# Altium project HANC1.0.PrjPcb
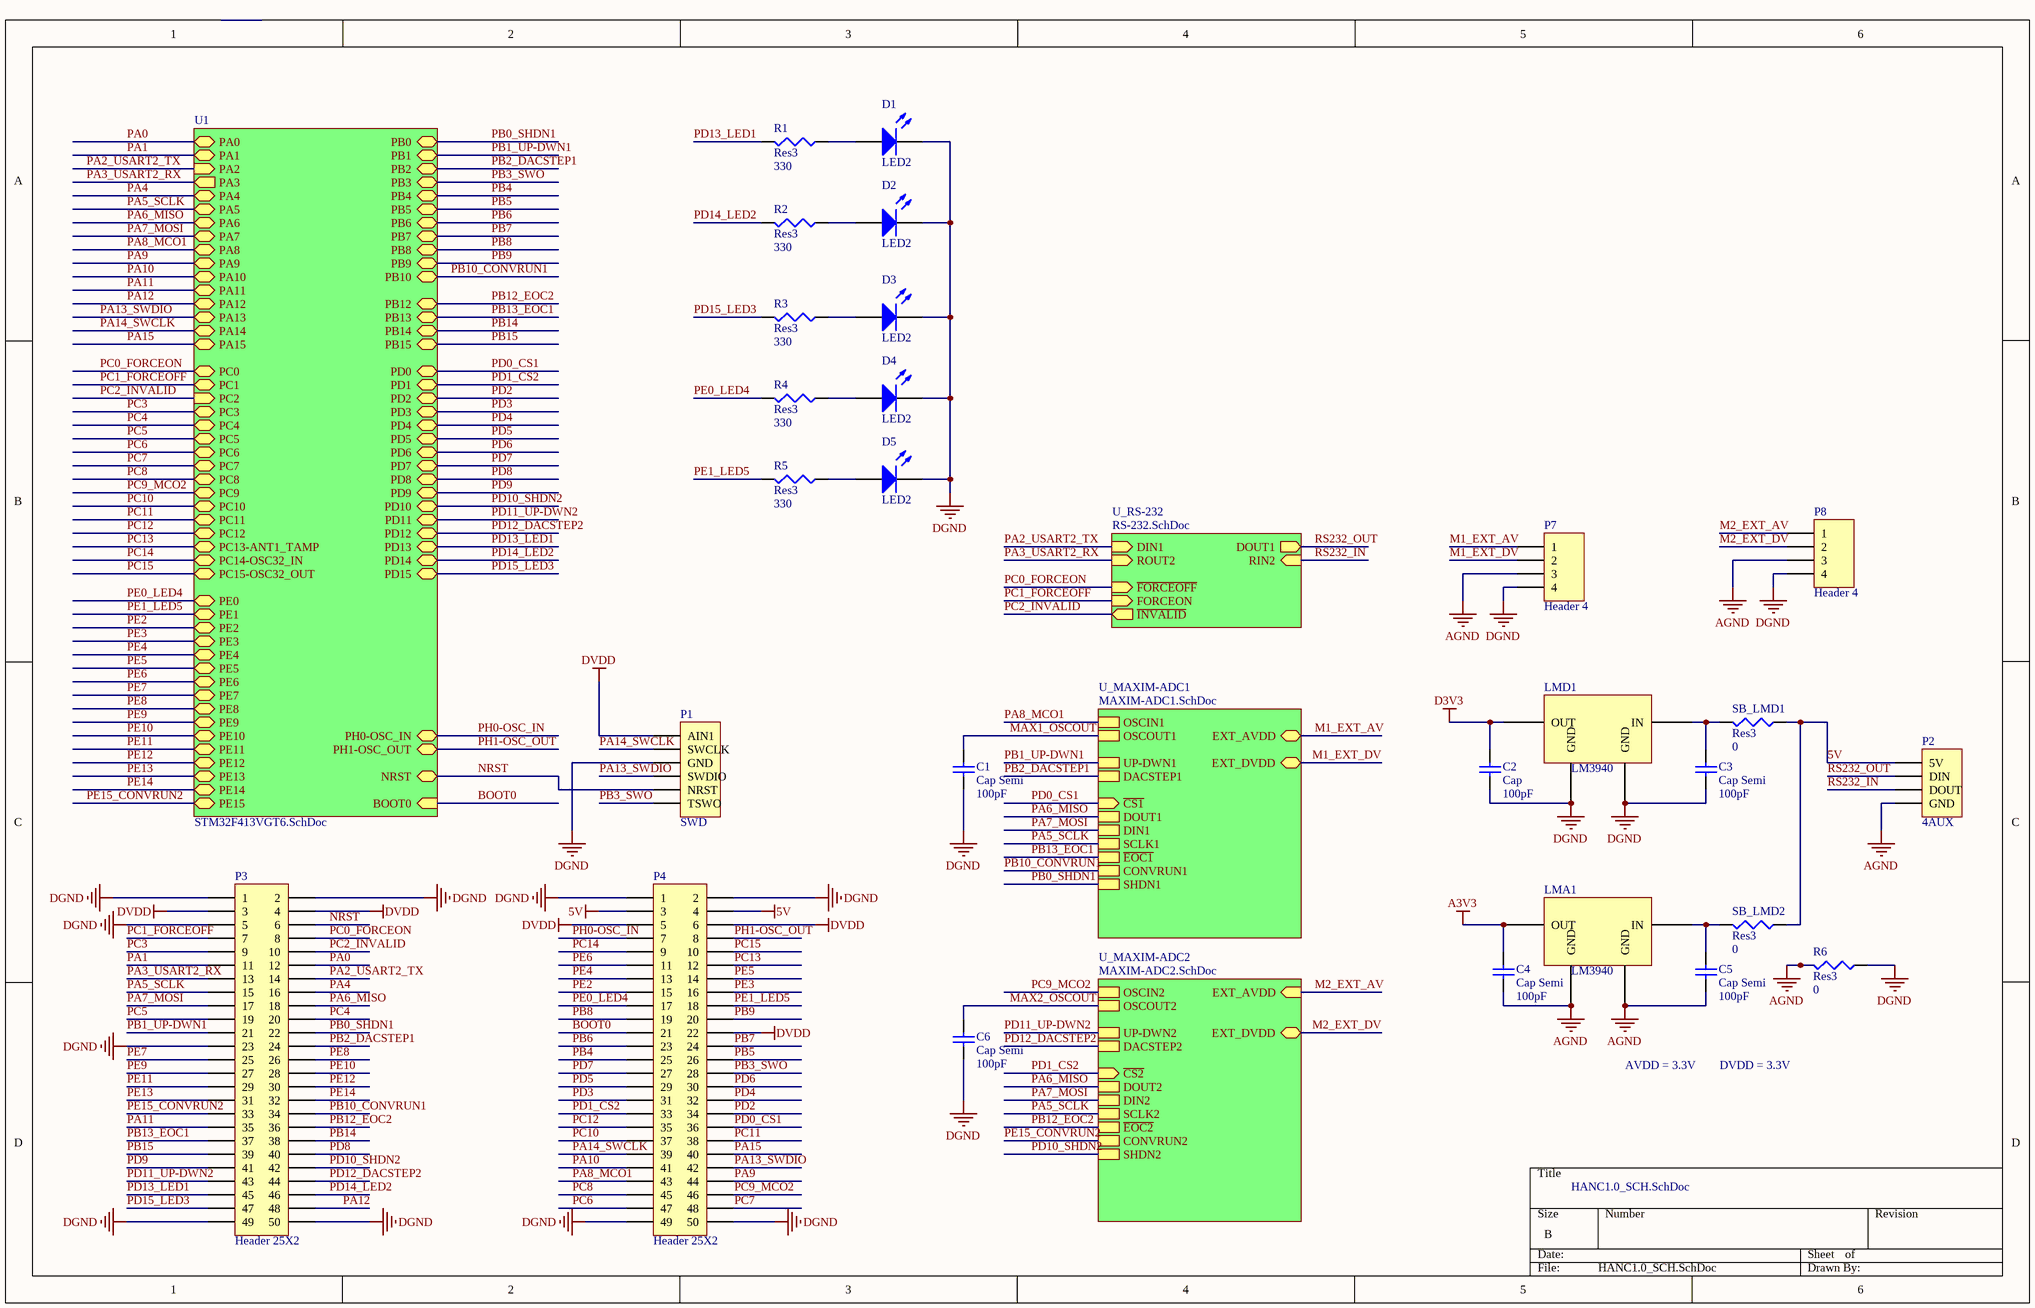
[diagram p0: HANC1.0_SCH.SchDoc]
7 sheets, 215 parts. Net scope: hierarchical (ports join the sheet entries above them; power ports are global).
Board file: HANCv1.PcbDoc
Sheets:
  HANC1.0_SCH.SchDoc
    U1 = STM32F413VGT6.SchDoc
    U_RS-232 = RS-232.SchDoc
    U_MAXIM-ADC2 = MAXIM-ADC2.SchDoc
      HAMP2 = HydrophoneGroup2FilterAndAmpCircuit.SchDoc
    U_MAXIM-ADC1 = MAXIM-ADC1.SchDoc
      HAMP1 = HydrophoneGroup1FilterAndAmpCircuit.SchDoc

## Sheet HANC1.0_SCH.SchDoc
size B

### Parts
C1  Cap Semi  value 100pF  [1608[0603]]
C2  Cap  value 100pF  [1608[0603]]
C3  Cap Semi  value 100pF  [1608[0603]]
C4  Cap Semi  value 100pF  [1608[0603]]
C5  Cap Semi  value 100pF  [1608[0603]]
C6  Cap Semi  value 100pF  [1608[0603]]
D1  LED2  [3.2X1.6X1.1]
D2  LED2  [3.2X1.6X1.1]
D3  LED2  [3.2X1.6X1.1]
D4  LED2  [3.2X1.6X1.1]
D5  LED2  [3.2X1.6X1.1]
LMA1  LM3940  [SOT223_N]
LMD1  LM3940  [SOT223_N]
P1  SWD  [HDR1X6]
P2  4AUX  [HDR1X4]
P3  Header 25X2  [HDR2X25]
P4  Header 25X2  [HDR2X25]
P7  Header 4  [HDR1X4]
P8  Header 4  [HDR1X4]
R1  Res3  value 330  [J1-0603]
R2  Res3  value 330  [J1-0603]
R3  Res3  value 330  [J1-0603]
R4  Res3  value 330  [J1-0603]
R5  Res3  value 330  [J1-0603]
R6  Res3  value 0  [J1-0603]
SB_LMD1  Res3  value 0  [J1-0603]
SB_LMD2  Res3  value 0  [J1-0603]

### Sub-sheets
U1 = STM32F413VGT6.SchDoc: PE2 (bidir), PH0-OSC_IN (bidir), PH1-OSC_OUT (bidir), NRST (bidir), PC0 (bidir), PC1 (bidir), PC2 (in), PC3 (bidir), PE3 (bidir), PA0 (bidir), PA1 (bidir), PA2 (in), PA3 (out), PA4 (bidir), PE4 (bidir), PA5 (bidir), PA6 (bidir), PA7 (bidir), PC4 (bidir), PC5 (bidir), PB0 (bidir), PB1 (bidir), PB2 (bidir), PE7 (bidir), PE8 (bidir), PE5 (bidir), PE9 (bidir), PE10 (bidir), PE11 (bidir), PE12 (bidir), PE13 (bidir), PE14 (bidir), PE15 (bidir), PB10 (bidir), PE6 (bidir), PB12 (bidir), PB13 (bidir), PB14 (bidir), PB15 (bidir), PD8 (bidir), PD9 (bidir), PD10 (bidir), PD11 (bidir), PD12 (bidir), PD13 (bidir), PD14 (bidir), PD15 (bidir), PC6 (bidir), PC7 (bidir), PC8 (bidir), PC9 (bidir), PA8 (bidir), PA9 (bidir), PA10 (bidir), PC13-ANT1_TAMP (bidir), PA11 (bidir), PA12 (bidir), PA13 (bidir), PA14 (bidir), PA15 (bidir), PC10 (bidir), PC11 (bidir), PC14-OSC32_IN (bidir), PC12 (bidir), PD0 (bidir), PD1 (bidir), PD2 (bidir), PD3 (bidir), PD4 (bidir), PD5 (bidir), PD6 (bidir), PD7 (bidir), PB3 (bidir), PC15-OSC32_OUT (bidir), PB4 (bidir), PB5 (bidir), PB6 (bidir), PB7 (bidir), BOOT0, PB8 (bidir), PB9 (bidir), PE0 (bidir), PE1 (bidir)
U_MAXIM-ADC1 = MAXIM-ADC1.SchDoc: OSCIN1, OSCOUT1, UP-DWN1, DACSTEP1, ~{CS1} (in), DOUT1, DIN1, SCLK1, ~{EOC1}, CONVRUN1, SHDN1, EXT_AVDD, EXT_DVDD
U_MAXIM-ADC2 = MAXIM-ADC2.SchDoc: OSCIN2, OSCOUT2, UP-DWN2, DACSTEP2, ~{CS2} (in), DOUT2, DIN2, SCLK2, ~{EOC2}, CONVRUN2, SHDN2, EXT_AVDD (in), EXT_DVDD
U_RS-232 = RS-232.SchDoc: DIN1 (in), RIN2 (in), ~{FORCEOFF} (in), FORCEON (in), DOUT1 (out), ROUT2 (in), ~{INVALID} (out)

### Nets
5V: P2.1(5V) P4.3 P4.4 SB_LMD1.1 SB_LMD2.1
A3V3: C4.2 LMA1.3(OUT)
AGND: C4.1 C5.1 LMA1.2(GND) LMA1.4(GND) P2.4(GND) P7.3 P8.3 R6.2
D3V3: C2.2 LMD1.3(OUT)
DGND: C1.1 C2.1 C3.1 C6.1 D1.2(K) D2.2(K) D3.2(K) D4.2(K) D5.2(K) LMD1.2(GND) LMD1.4(GND) P1.3(GND) P3.1 P3.2 P3.5 P3.23 P3.49 P3.50 P4.1 P4.2 P4.49 P4.50 P7.4 P8.4 R6.1
DVDD: P1.1(AIN1) P3.3 P3.4 P4.5 P4.6 P4.22
BOOT0: P4.21 ; sheet U1/BOOT0
M1_EXT_AV: P7.1 ; sheet U_MAXIM-ADC1/EXT_AVDD
M1_EXT_DV: P7.2 ; sheet U_MAXIM-ADC1/EXT_DVDD
M2_EXT_AV: P8.1 ; sheet U_MAXIM-ADC2/EXT_AVDD
M2_EXT_DV: P8.2 ; sheet U_MAXIM-ADC2/EXT_DVDD
MAX1_OSCOUT: C1.2 ; sheet U_MAXIM-ADC1/OSCOUT1
MAX2_OSCOUT: C6.2 ; sheet U_MAXIM-ADC2/OSCOUT2
NRST: P1.5(NRST) P3.6 ; sheet U1/NRST
PA0: P3.12 ; sheet U1/PA0
PA1: P3.11 ; sheet U1/PA1
PA2_USART2_TX: P3.14 ; sheet U1/PA2, sheet U_RS-232/DIN1
PA3_USART2_RX: P3.13 ; sheet U1/PA3, sheet U_RS-232/ROUT2
PA4: P3.16 ; sheet U1/PA4
PA5_SCLK: P3.15 ; sheet U1/PA5, sheet U_MAXIM-ADC2/SCLK2, sheet U_MAXIM-ADC1/SCLK1
PA6_MISO: P3.18 ; sheet U1/PA6, sheet U_MAXIM-ADC2/DOUT2, sheet U_MAXIM-ADC1/DOUT1
PA7_MOSI: P3.17 ; sheet U1/PA7, sheet U_MAXIM-ADC2/DIN2, sheet U_MAXIM-ADC1/DIN1
PA8_MCO1: P4.43 ; sheet U1/PA8, sheet U_MAXIM-ADC1/OSCIN1
PA9: P4.44 ; sheet U1/PA9
PA10: P4.41 ; sheet U1/PA10
PA11: P3.35 ; sheet U1/PA11
PA12: P3.48 ; sheet U1/PA12
PA13_SWDIO: P1.4(SWDIO) P4.42 ; sheet U1/PA13
PA14_SWCLK: P1.2(SWCLK) P4.39 ; sheet U1/PA14
PA15: P4.40 ; sheet U1/PA15
PB0_SHDN1: P3.22 ; sheet U1/PB0, sheet U_MAXIM-ADC1/SHDN1
PB1_UP-DWN1: P3.21 ; sheet U1/PB1, sheet U_MAXIM-ADC1/UP-DWN1
PB2_DACSTEP1: P3.24 ; sheet U1/PB2, sheet U_MAXIM-ADC1/DACSTEP1
PB3_SWO: P1.6(TSWO) P4.28 ; sheet U1/PB3
PB4: P4.25 ; sheet U1/PB4
PB5: P4.26 ; sheet U1/PB5
PB6: P4.23 ; sheet U1/PB6
PB7: P4.24 ; sheet U1/PB7
PB8: P4.19 ; sheet U1/PB8
PB9: P4.20 ; sheet U1/PB9
PB10_CONVRUN1: P3.34 ; sheet U1/PB10, sheet U_MAXIM-ADC1/CONVRUN1
PB12_EOC2: P3.36 ; sheet U1/PB12, sheet U_MAXIM-ADC2/~{EOC2}
PB13_EOC1: P3.37 ; sheet U1/PB13, sheet U_MAXIM-ADC1/~{EOC1}
PB14: P3.38 ; sheet U1/PB14
PB15: P3.39 ; sheet U1/PB15
PC0_FORCEON: P3.8 ; sheet U1/PC0, sheet U_RS-232/~{FORCEOFF}
PC1_FORCEOFF: P3.7 ; sheet U1/PC1, sheet U_RS-232/FORCEON
PC2_INVALID: P3.10 ; sheet U1/PC2, sheet U_RS-232/~{INVALID}
PC3: P3.9 ; sheet U1/PC3
PC4: P3.20 ; sheet U1/PC4
PC5: P3.19 ; sheet U1/PC5
PC6: P4.47 ; sheet U1/PC6
PC7: P4.48 ; sheet U1/PC7
PC8: P4.45 ; sheet U1/PC8
PC9_MCO2: P4.46 ; sheet U1/PC9, sheet U_MAXIM-ADC2/OSCIN2
PC10: P4.37 ; sheet U1/PC10
PC11: P4.38 ; sheet U1/PC11
PC12: P4.35 ; sheet U1/PC12
PC13: P4.12 ; sheet U1/PC13-ANT1_TAMP
PC14: P4.9 ; sheet U1/PC14-OSC32_IN
PC15: P4.10 ; sheet U1/PC15-OSC32_OUT
PD0_CS1: P4.36 ; sheet U1/PD0, sheet U_MAXIM-ADC1/~{CS1}
PD1_CS2: P4.33 ; sheet U1/PD1, sheet U_MAXIM-ADC2/~{CS2}
PD2: P4.34 ; sheet U1/PD2
PD3: P4.31 ; sheet U1/PD3
PD4: P4.32 ; sheet U1/PD4
PD5: P4.29 ; sheet U1/PD5
PD6: P4.30 ; sheet U1/PD6
PD7: P4.27 ; sheet U1/PD7
PD8: P3.40 ; sheet U1/PD8
PD9: P3.41 ; sheet U1/PD9
PD10_SHDN2: P3.42 ; sheet U1/PD10, sheet U_MAXIM-ADC2/SHDN2
PD11_UP-DWN2: P3.43 ; sheet U1/PD11, sheet U_MAXIM-ADC2/UP-DWN2
PD12_DACSTEP2: P3.44 ; sheet U1/PD12, sheet U_MAXIM-ADC2/DACSTEP2
PD13_LED1: P3.45 R1.2 ; sheet U1/PD13
PD14_LED2: P3.46 R2.2 ; sheet U1/PD14
PD15_LED3: P3.47 R3.2 ; sheet U1/PD15
PE0_LED4: P4.17 R4.2 ; sheet U1/PE0
PE1_LED5: P4.18 R5.2 ; sheet U1/PE1
PE2: P4.15 ; sheet U1/PE2
PE3: P4.16 ; sheet U1/PE3
PE4: P4.13 ; sheet U1/PE4
PE5: P4.14 ; sheet U1/PE5
PE6: P4.11 ; sheet U1/PE6
PE7: P3.25 ; sheet U1/PE7
PE8: P3.26 ; sheet U1/PE8
PE9: P3.27 ; sheet U1/PE9
PE10: P3.28 ; sheet U1/PE10
PE11: P3.29 ; sheet U1/PE11
PE12: P3.30 ; sheet U1/PE12
PE13: P3.31 ; sheet U1/PE13
PE14: P3.32 ; sheet U1/PE14
PE15_CONVRUN2: P3.33 ; sheet U1/PE15, sheet U_MAXIM-ADC2/CONVRUN2
PH0-OSC_IN: P4.7 ; sheet U1/PH0-OSC_IN
PH1-OSC_OUT: P4.8 ; sheet U1/PH1-OSC_OUT
RS232_IN: P2.3(DOUT) ; sheet U_RS-232/RIN2
RS232_OUT: P2.2(DIN) ; sheet U_RS-232/DOUT1
NetC3_2: C3.2 LMD1.1(IN) SB_LMD1.2
NetC5_2: C5.2 LMA1.1(IN) SB_LMD2.2
NetD1_1: D1.1(A) R1.1
NetD2_1: D2.1(A) R2.1
NetD3_1: D3.1(A) R3.1
NetD4_1: D4.1(A) R4.1
NetD5_1: D5.1(A) R5.1

### Notes on the sheet
- AVDD = 3.3V
- DVDD = 3.3V

### Library data of the parts
C1-C6 = Cap Semi: Capacitor (Semiconductor SIM Model); Published: 8-Jun-2000; LatestRevisionDate: 29-May-2009; LatestRevisionNote: IPC-7351 Footprint Added.; PackageReference: C1206; Publisher: Altium Limited; PackageDescription: Chip Capacitor
D1-D5 = LED2: Typical RED, GREEN, YELLOW, AMBER GaAs LED; Published: 8-Jun-2000; LatestRevisionDate: 17-Jul-2002; LatestRevisionNote: Re-released for DXP Platform.; PackageVersion: Feb-2002; PackageReference: 3.2X1.6X1.1; Publisher: Altium Limited; PackageDescription: SM LED; 2 Flat Leads
LMA1 LMD1 = Component_1
P1 = Header 6: Header, 6-Pin; LatestRevisionDate: 17-Jul-2002; LatestRevisionNote: Re-released for DXP Platform.; Publisher: Altium Limited
P2 P7 P8 = Header 4: Header, 4-Pin; LatestRevisionDate: 17-Jul-2002; LatestRevisionNote: Re-released for DXP Platform.; Publisher: Altium Limited
P3 P4 = Header 25X2: Header, 25-Pin, Dual row; LatestRevisionDate: 17-Jul-2002; LatestRevisionNote: Re-released for DXP Platform.; Publisher: Altium Limited
R1-R6 SB_LMD1 SB_LMD2 = Res3: Resistor; Published: 8-Jun-2000; LatestRevisionDate: 29-May-2009; LatestRevisionNote: IPC-7351 Footprint Added.; PackageReference: J1-0603; Publisher: Altium Limited; PackageDescription: Chip Resistor

## Sheet STM32F413VGT6.SchDoc
size A3; PageSetup: Record=PageOptions|CenterHorizontal=True|CenterVertical=True|PrintScale=0.70|XCorrection=1.00|YCorrection=1.00|PrintKind=1|BorderSize=5000000|LeftOffset=0|BottomOffset=0|Orientation=2|PaperLength=1000|PaperWidth=1000|Scale=100|PaperSource=7|PrintQuality=600|MediaType=1|DitherType=10|PrintScaleMode=1|PaperKind=Letter|PaperIndex=1
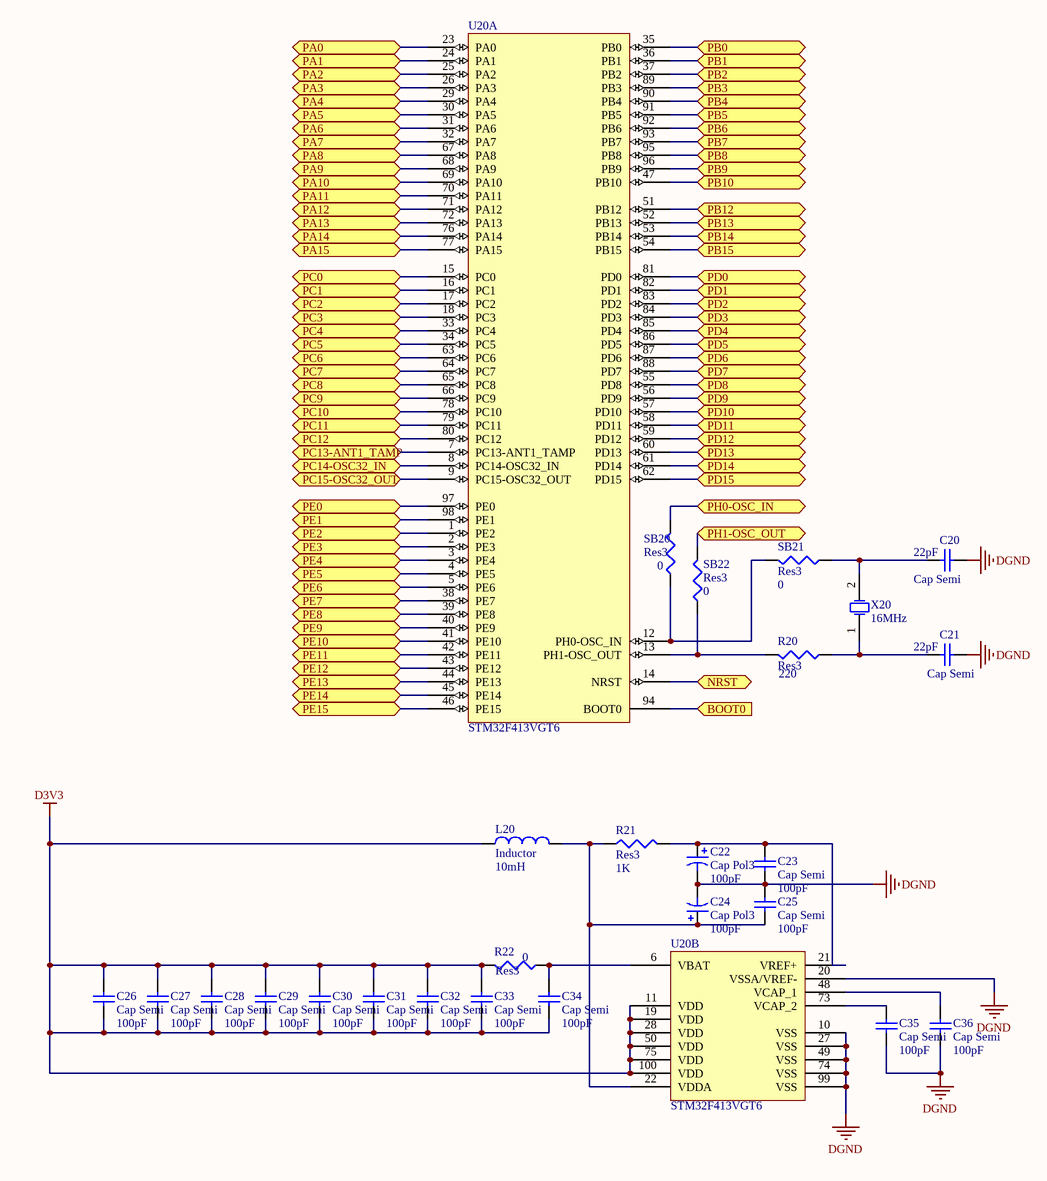
[diagram p1: STM32F413VGT6.SchDoc]

### Parts
(Parts that share a designator on the sheet are numbered #1, #2 ... from top to bottom, then left to right.)
C20  Cap Semi  value 22pF  [1608[0603]]
C21  Cap Semi  value 22pF  [1608[0603]]
C22  Cap Pol3  value 100pF  [C0805]
C23  Cap Semi  value 100pF  [1608[0603]]
C24  Cap Pol3  value 100pF  [C0805]
C25  Cap Semi  value 100pF  [1608[0603]]
C26  Cap Semi  value 100pF  [1608[0603]]
C27  Cap Semi  value 100pF  [1608[0603]]
C28  Cap Semi  value 100pF  [1608[0603]]
C29  Cap Semi  value 100pF  [1608[0603]]
C30  Cap Semi  value 100pF  [1608[0603]]
C31  Cap Semi  value 100pF  [1608[0603]]
C32  Cap Semi  value 100pF  [1608[0603]]
C33  Cap Semi  value 100pF  [1608[0603]]
C34  Cap Semi  value 100pF  [1608[0603]]
C35  Cap Semi  value 100pF  [1608[0603]]
C36  Cap Semi  value 100pF  [1608[0603]]
L20  Inductor  value 10mH  [0603]
R20  Res3  value 220  [J1-0603]
R21  Res3  value 1K  [J1-0603]
R22  Res3  value 0  [J1-0603]
SB20  Res3  value 0  [J1-0603]
SB21  Res3  value 0  [J1-0603]
SB22  Res3  value 0  [J1-0603]
U20#1  STM32F413VGT6  [STM-LQFP100_V]  (part A of 2)
U20#2  STM32F413VGT6  [STM-LQFP100_V]  (part B of 2)
X20  16MHz  [R38]

### Ports
BOOT0, NRST (bidir), PA0 (bidir), PA1 (bidir), PA2 (bidir), PA3 (bidir), PA4 (bidir), PA5 (bidir), PA6 (bidir), PA7 (bidir), PA8 (bidir), PA9 (bidir), PA10 (bidir), PA11 (bidir), PA12 (bidir), PA13 (bidir), PA14 (bidir), PA15 (bidir), PB0 (bidir), PB1 (bidir), PB2 (bidir), PB3 (bidir), PB4 (bidir), PB5 (bidir), PB6 (bidir), PB7 (bidir), PB8 (bidir), PB9 (bidir), PB10 (bidir), PB12 (bidir), PB13 (bidir), PB14 (bidir), PB15 (bidir), PC0 (bidir), PC1 (bidir), PC2 (bidir), PC3 (bidir), PC4 (bidir), PC5 (bidir), PC6 (bidir), PC7 (bidir), PC8 (bidir), PC9 (bidir), PC10 (bidir), PC11 (bidir), PC12 (bidir), PC13-ANT1_TAMP (bidir), PC14-OSC32_IN (bidir), PC15-OSC32_OUT (bidir), PD0 (bidir), PD1 (bidir), PD2 (bidir), PD3 (bidir), PD4 (bidir), PD5 (bidir), PD6 (bidir), PD7 (bidir), PD8 (bidir), PD9 (bidir), PD10 (bidir), PD11 (bidir), PD12 (bidir), PD13 (bidir), PD14 (bidir), PD15 (bidir), PE0 (bidir), PE1 (bidir), PE2 (bidir), PE3 (bidir), PE4 (bidir), PE5 (bidir), PE6 (bidir), PE7 (bidir), PE8 (bidir), PE9 (bidir), PE10 (bidir), PE11 (bidir), PE12 (bidir), PE13 (bidir), PE14 (bidir), PE15 (bidir), PH0-OSC_IN (bidir), PH1-OSC_OUT (bidir)

### Nets
D3V3: C26.1 C26.2 C27.1 C27.2 C28.1 C28.2 C29.1 C29.2 C30.1 C30.2 C31.1 C31.2 C32.1 C32.2 C33.1 C33.2 C34.1 L20.1 R22.2 U20#2.11(VDD) U20#2.19(VDD) U20#2.28(VDD) U20#2.50(VDD) U20#2.75(VDD) U20#2.100(VDD)
DGND: C20.2 C21.2 C22.2 C23.1 C24.2 C25.2 C35.1 C36.1 U20#2.10(VSS) U20#2.20(VSSA/VREF-) U20#2.27(VSS) U20#2.49(VSS) U20#2.74(VSS) U20#2.99(VSS)
BOOT0: U20#1.94(BOOT0) ; port BOOT0
NRST: U20#1.14(NRST) ; port NRST
PA0: U20#1.23(PA0) ; port PA0
PA1: U20#1.24(PA1) ; port PA1
PA2_USART2_TX: U20#1.25(PA2) ; port PA2
PA3_USART2_RX: U20#1.26(PA3) ; port PA3
PA4: U20#1.29(PA4) ; port PA4
PA5_SCLK: U20#1.30(PA5) ; port PA5
PA6_MISO: U20#1.31(PA6) ; port PA6
PA7_MOSI: U20#1.32(PA7) ; port PA7
PA8_MCO1: U20#1.67(PA8) ; port PA8
PA9: U20#1.68(PA9) ; port PA9
PA10: U20#1.69(PA10) ; port PA10
PA11: U20#1.70(PA11) ; port PA11
PA12: U20#1.71(PA12) ; port PA12
PA13_SWDIO: U20#1.72(PA13) ; port PA13
PA14_SWCLK: U20#1.76(PA14) ; port PA14
PA15: U20#1.77(PA15) ; port PA15
PB0_SHDN1: U20#1.35(PB0) ; port PB0
PB1_UP-DWN1: U20#1.36(PB1) ; port PB1
PB2_DACSTEP1: U20#1.37(PB2) ; port PB2
PB3_SWO: U20#1.89(PB3) ; port PB3
PB4: U20#1.90(PB4) ; port PB4
PB5: U20#1.91(PB5) ; port PB5
PB6: U20#1.92(PB6) ; port PB6
PB7: U20#1.93(PB7) ; port PB7
PB8: U20#1.95(PB8) ; port PB8
PB9: U20#1.96(PB9) ; port PB9
PB10_CONVRUN1: U20#1.47(PB10) ; port PB10
PB12_EOC2: U20#1.51(PB12) ; port PB12
PB13_EOC1: U20#1.52(PB13) ; port PB13
PB14: U20#1.53(PB14) ; port PB14
PB15: U20#1.54(PB15) ; port PB15
PC0_FORCEON: U20#1.15(PC0) ; port PC0
PC1_FORCEOFF: U20#1.16(PC1) ; port PC1
PC2_INVALID: U20#1.17(PC2) ; port PC2
PC3: U20#1.18(PC3) ; port PC3
PC4: U20#1.33(PC4) ; port PC4
PC5: U20#1.34(PC5) ; port PC5
PC6: U20#1.63(PC6) ; port PC6
PC7: U20#1.64(PC7) ; port PC7
PC8: U20#1.65(PC8) ; port PC8
PC9_MCO2: U20#1.66(PC9) ; port PC9
PC10: U20#1.78(PC10) ; port PC10
PC11: U20#1.79(PC11) ; port PC11
PC12: U20#1.80(PC12) ; port PC12
PC13: U20#1.7(PC13-ANT1_TAMP) ; port PC13-ANT1_TAMP
PC14: U20#1.8(PC14-OSC32_IN) ; port PC14-OSC32_IN
PC15: U20#1.9(PC15-OSC32_OUT) ; port PC15-OSC32_OUT
PD0_CS1: U20#1.81(PD0) ; port PD0
PD1_CS2: U20#1.82(PD1) ; port PD1
PD2: U20#1.83(PD2) ; port PD2
PD3: U20#1.84(PD3) ; port PD3
PD4: U20#1.85(PD4) ; port PD4
PD5: U20#1.86(PD5) ; port PD5
PD6: U20#1.87(PD6) ; port PD6
PD7: U20#1.88(PD7) ; port PD7
PD8: U20#1.55(PD8) ; port PD8
PD9: U20#1.56(PD9) ; port PD9
PD10_SHDN2: U20#1.57(PD10) ; port PD10
PD11_UP-DWN2: U20#1.58(PD11) ; port PD11
PD12_DACSTEP2: U20#1.59(PD12) ; port PD12
PD13_LED1: U20#1.60(PD13) ; port PD13
PD14_LED2: U20#1.61(PD14) ; port PD14
PD15_LED3: U20#1.62(PD15) ; port PD15
PE0_LED4: U20#1.97(PE0) ; port PE0
PE1_LED5: U20#1.98(PE1) ; port PE1
PE2: U20#1.1(PE2) ; port PE2
PE3: U20#1.2(PE3) ; port PE3
PE4: U20#1.3(PE4) ; port PE4
PE5: U20#1.4(PE5) ; port PE5
PE6: U20#1.5(PE6) ; port PE6
PE7: U20#1.38(PE7) ; port PE7
PE8: U20#1.39(PE8) ; port PE8
PE9: U20#1.40(PE9) ; port PE9
PE10: U20#1.41(PE10) ; port PE10
PE11: U20#1.42(PE11) ; port PE11
PE12: U20#1.43(PE12) ; port PE12
PE13: U20#1.44(PE13) ; port PE13
PE14: U20#1.45(PE14) ; port PE14
PE15_CONVRUN2: U20#1.46(PE15) ; port PE15
PH0-OSC_IN: SB20.2 ; port PH0-OSC_IN
PH1-OSC_OUT: SB22.2 ; port PH1-OSC_OUT
NetC20_1: C20.1 SB21.1 X20.2(OSC2)
NetC21_1: C21.1 R20.1 X20.1(OSC1)
NetC22_1: C22.1 C23.2 R21.2 U20#2.21(VREF+)
NetC24_1: C24.1 C25.1 L20.2 R21.1 U20#2.22(VDDA)
NetC34_2: C34.2 R22.1 U20#2.6(VBAT)
NetC35_2: C35.2 U20#2.73(VCAP_2)
NetC36_2: C36.2 U20#2.48(VCAP_1)
NetR20_2: R20.2 SB22.1 U20#1.13(PH1-OSC_OUT)
NetSB20_1: SB20.1 SB21.2 U20#1.12(PH0-OSC_IN)

### Library data of the parts
C20 C21 C23 C25-C36 = Cap Semi: Capacitor (Semiconductor SIM Model); Published: 8-Jun-2000; LatestRevisionDate: 29-May-2009; LatestRevisionNote: IPC-7351 Footprint Added.; PackageReference: C1206; Publisher: Altium Limited; PackageDescription: Chip Capacitor
C22 C24 = Cap Pol3: Polarized Capacitor (Surface Mount); Published: 8-Jun-2000; LatestRevisionDate: 29-May-2009; LatestRevisionNote: IPC-7351 Footprint Added.; PackageReference: C0805; Publisher: Altium Limited; PackageDescription: Chip Capacitor
L20 = Inductor: Code_IEC: 1005; Published: 8-Jun-2000; LatestRevisionDate: 29-May-2009; LatestRevisionNote: IPC-7351 Footprint Added.; PackageReference: 0402-A; Publisher: Altium Limited; PackageDescription: Chip Inductor; Code_JEITA: 0402
R20-R22 SB21 = Res3: Resistor; Published: 8-Jun-2000; LatestRevisionDate: 29-May-2009; LatestRevisionNote: IPC-7351 Footprint Added.; PackageReference: J1-0603; Publisher: Altium Limited; PackageDescription: Chip Resistor
SB20 = Res3: SB PH0; Published: 8-Jun-2000; LatestRevisionDate: 29-May-2009; LatestRevisionNote: IPC-7351 Footprint Added.; PackageReference: J1-0603; Publisher: Altium Limited; PackageDescription: Chip Resistor
SB22 = Res3: SB_PH1; Published: 8-Jun-2000; LatestRevisionDate: 29-May-2009; LatestRevisionNote: IPC-7351 Footprint Added.; PackageReference: J1-0603; Publisher: Altium Limited; PackageDescription: Chip Resistor
U20#1 U20#2 = CMP-1771-00004-1: ARM Cortex-M4 32-Bit DSP+FPU, 1024 KB Flash, 82 I/Os, 100-Pin LQFP, -40 to 85 degC, Tray; ComponentLink1URL: http://www.st.com/; PackageDescription: 100-Pin Low Profile Quad Flat Package, Body 14 x 14 mm, Pitch 0.5 mm; Mounting Technology: Surface Mount; PackageReference: LQFP100; ComponentLink1Description: Manufacturer URL; DatasheetVersion: Rev. 1; PartId: 1
X20 = XTAL: Crystal Oscillator; Published: 8-Jun-2000; LatestRevisionDate: 17-Jul-2002; LatestRevisionNote: Re-released for DXP Platform.; PackageReference: R38; Publisher: Altium Limited; PackageDescription: Crystal, Thru-Hole; 2 Leads; Body 3.1 x 8.2 mm (Dia.xH)

## Sheet RS-232.SchDoc
size A
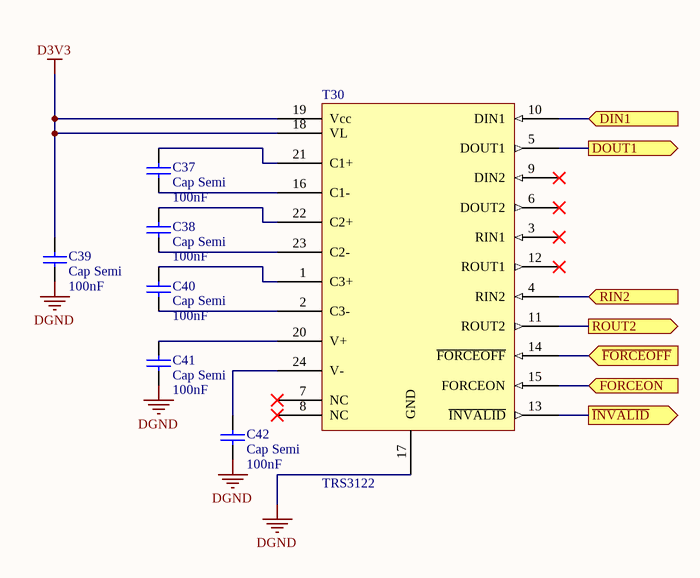
[diagram p2: RS-232.SchDoc]

### Parts
C37  Cap Semi  value 100nF  [1608[0603]]
C38  Cap Semi  value 100nF  [1608[0603]]
C39  Cap Semi  value 100nF  [1608[0603]]
C40  Cap Semi  value 100nF  [1608[0603]]
C41  Cap Semi  value 100nF  [1608[0603]]
C42  Cap Semi  value 100nF  [1608[0603]]
T30  TRS3122  [QFN50P485X485X100_HS-25N]

### Ports
DIN1 (in), DOUT1 (out), FORCEON (in), RIN2 (in), ROUT2 (out), ~{FORCEOFF} (in), ~{INVALID} (out)

### Nets
D3V3: C39.1 T30.18(VL) T30.19(Vcc)
DGND: C39.2 C41.2 C42.2 T30.17(GND)
PA2_USART2_TX: T30.10(DIN1) ; port DIN1
PA3_USART2_RX: T30.11(ROUT2) ; port ROUT2
PC0_FORCEON: T30.14(~{FORCEOFF}) ; port ~{FORCEOFF}
PC1_FORCEOFF: T30.15(FORCEON) ; port FORCEON
PC2_INVALID: T30.13(~{INVALID}) ; port ~{INVALID}
RS232_IN: T30.4(RIN2) ; port RIN2
RS232_OUT: T30.5(DOUT1) ; port DOUT1
NetC37_1: C37.1 T30.21(C1+)
NetC37_2: C37.2 T30.16(C1-)
NetC38_1: C38.1 T30.22(C2+)
NetC38_2: C38.2 T30.23(C2-)
NetC40_1: C40.1 T30.1(C3+)
NetC40_2: C40.2 T30.2(C3-)
NetC41_1: C41.1 T30.20(V+)
NetC42_1: C42.1 T30.24(V-)

Not connected (* = marked no-connect by the designer): T30 3(RIN1)* 6(DOUT2)* 7(NC)* 8(NC)* 9(DIN2)* 12(ROUT1)*

### Library data of the parts
C37-C42 = Cap Semi: Capacitor (Semiconductor SIM Model); Published: 8-Jun-2000; LatestRevisionDate: 29-May-2009; LatestRevisionNote: IPC-7351 Footprint Added.; PackageReference: C1206; Publisher: Altium Limited; PackageDescription: Chip Capacitor
T30 = Component_1

## Sheet MAXIM-ADC2.SchDoc
size B
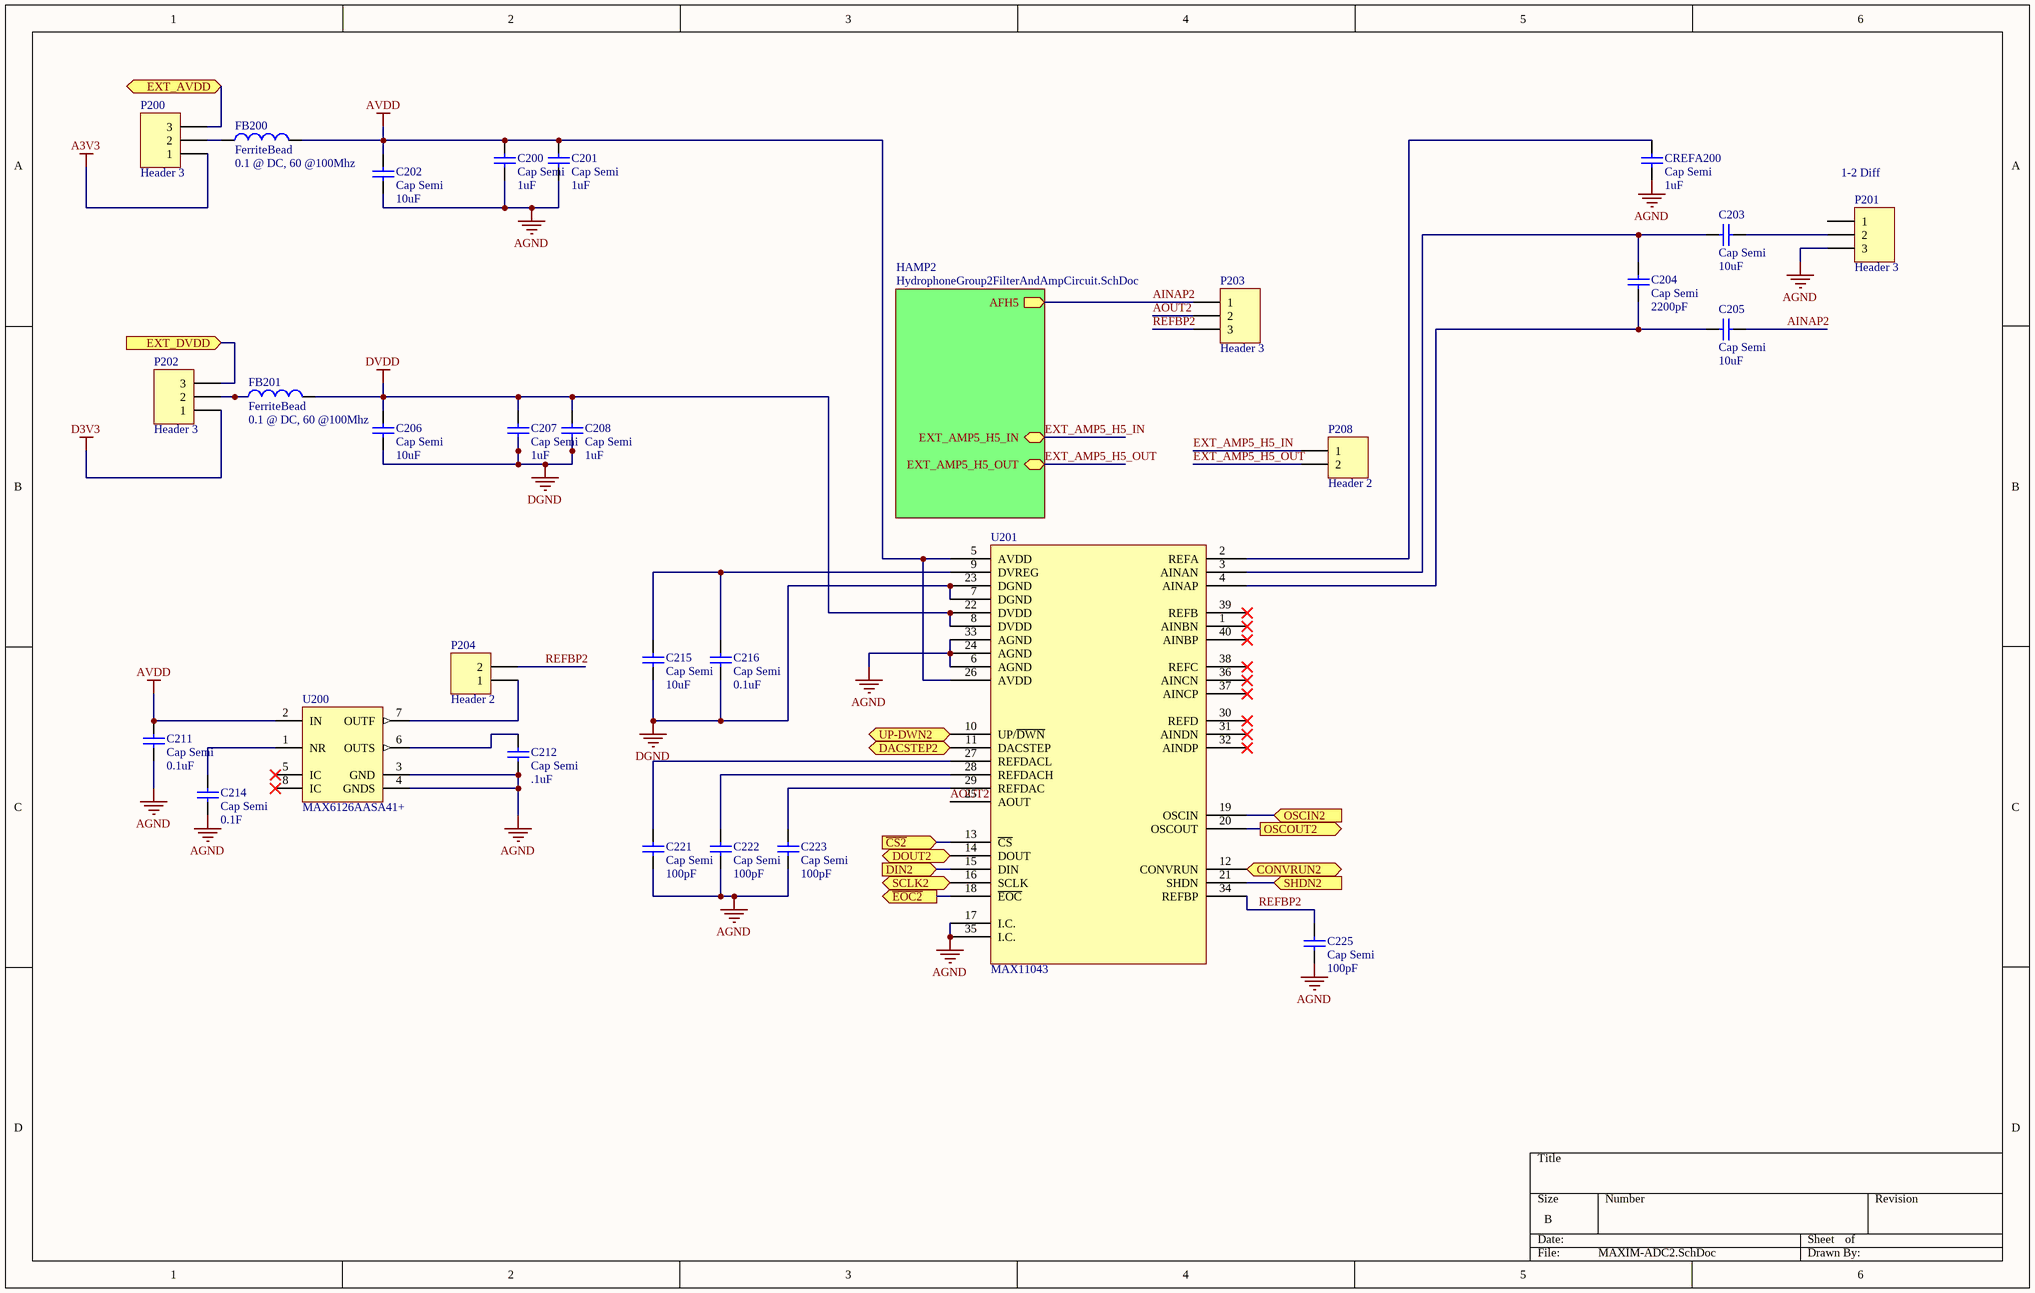
[diagram p3: MAXIM-ADC2.SchDoc]

### Parts
C200  Cap Semi  value 1uF  [1608[0603]]
C201  Cap Semi  value 1uF  [1608[0603]]
C202  Cap Semi  value 10uF  [1608[0603]]
C203  Cap Semi  value 10uF  [1608[0603]]
C204  Cap Semi  value 2200pF  [1608[0603]]
C205  Cap Semi  value 10uF  [1608[0603]]
C206  Cap Semi  value 10uF  [1608[0603]]
C207  Cap Semi  value 1uF  [1608[0603]]
C208  Cap Semi  value 1uF  [1608[0603]]
C211  Cap Semi  value 0.1uF  [1608[0603]]
C212  Cap Semi  value .1uF  [1608[0603]]
C214  Cap Semi  value 0.1F  [1608[0603]]
C215  Cap Semi  value 10uF  [1608[0603]]
C216  Cap Semi  value 0.1uF  [1608[0603]]
C221  Cap Semi  value 100pF  [1608[0603]]
C222  Cap Semi  value 100pF  [1608[0603]]
C223  Cap Semi  value 100pF  [1608[0603]]
C225  Cap Semi  value 100pF  [1608[0603]]
CREFA200  Cap Semi  value 1uF  [1608[0603]]
FB200  FerriteBead  value 0.1 @ DC, 60 @100Mhz  [0603]
FB201  FerriteBead  value 0.1 @ DC, 60 @100Mhz  [0603]
P200  Header 3  [HDR1X3]
P201  Header 3  [HDR1X3]
P202  Header 3  [HDR1X3]
P203  Header 3  [HDR1X3]
P204  Header 2  [HDR1X2]
P208  Header 2  [HDR1X2]
U200  MAX6126AASA41+  [MAXM-S8+4_M]
U201  MAX11043  [QFN50P600X600X80_HS-41N]

### Sub-sheets
HAMP2 = HydrophoneGroup2FilterAndAmpCircuit.SchDoc: AFH5 (out), EXT_AMP5_H5_IN, EXT_AMP5_H5_OUT

### Ports
CONVRUN2 (in), DACSTEP2 (in), DIN2 (in), DOUT2, EXT_AVDD, EXT_DVDD (in), OSCIN2 (in), OSCOUT2 (out), SCLK2 (in), SHDN2 (in), UP-DWN2 (in), ~{CS2} (in), ~{EOC2} (out)

### Nets
A3V3: P200.1
AGND: C200.2 C201.2 C202.2 C211.2 C212.2 C214.2 C221.1 C222.2 C223.1 C225.2 CREFA200.1 P201.3 U200.3(GND) U200.4(GNDS) U201.6(AGND) U201.17(I.C.) U201.24(AGND) U201.33(AGND) U201.35(I.C.)
AVDD: C200.1 C201.1 C202.1 C211.1 FB200.2 U200.2(IN) U201.5(AVDD) U201.26(AVDD)
D3V3: P202.1
DGND: C206.2 C207.2 C208.2 C215.2 C216.2 U201.7(DGND) U201.23(DGND)
DVDD: C206.1 C207.1 C208.1 FB201.2 U201.8(DVDD) U201.22(DVDD)
AINAP2: C205.1 P203.1 ; sheet HAMP2/AFH5
AOUT2: P203.2 U201.25(AOUT)
EXT_AMP5_H5_IN: P208.1 ; sheet HAMP2/EXT_AMP5_H5_IN
EXT_AMP5_H5_OUT: P208.2 ; sheet HAMP2/EXT_AMP5_H5_OUT
M2_EXT_AV: P200.3 ; port EXT_AVDD
M2_EXT_DV: P202.3 ; port EXT_DVDD
MAX2_OSCOUT: U201.20(OSCOUT) ; port OSCOUT2
PA5_SCLK: U201.16(SCLK) ; port SCLK2
PA6_MISO: U201.14(DOUT) ; port DOUT2
PA7_MOSI: U201.15(DIN) ; port DIN2
PB12_EOC2: U201.18(~{EOC}) ; port ~{EOC2}
PC9_MCO2: U201.19(OSCIN) ; port OSCIN2
PD1_CS2: U201.13(~{CS}) ; port ~{CS2}
PD10_SHDN2: U201.21(SHDN) ; port SHDN2
PD11_UP-DWN2: U201.10(UP/~{DWN}) ; port UP-DWN2
PD12_DACSTEP2: U201.11(DACSTEP) ; port DACSTEP2
PE15_CONVRUN2: U201.12(CONVRUN) ; port CONVRUN2
REFBP2: C225.1 P203.3 P204.2 U201.34(REFBP)
NetC203_1: C203.1 P201.2
NetC203_2: C203.2 C204.2 U201.3(AINAN)
NetC204_1: C204.1 C205.2 U201.4(AINAP)
NetC212_1: C212.1 U200.6(OUTS)
NetC214_1: C214.1 U200.1(NR)
NetC215_1: C215.1 C216.1 U201.9(DVREG)
NetC221_2: C221.2 U201.27(REFDACL)
NetC222_1: C222.1 U201.28(REFDACH)
NetC223_2: C223.2 U201.29(REFDAC)
NetCREFA200_2: CREFA200.2 U201.2(REFA)
NetFB200_1: FB200.1 P200.2
NetFB201_1: FB201.1 P202.2
NetP204_1: P204.1 U200.7(OUTF)

Not connected (* = marked no-connect by the designer): P201 1; U200 5(IC)* 8(IC)*; U201 1(AINBN)* 30(REFD)* 31(AINDN)* 32(AINDP)* 36(AINCN)* 37(AINCP)* 38(REFC)* 39(REFB)* 40(AINBP)*

### Notes on the sheet
- (near P201) 1-2 Diff

### Library data of the parts
C200-C208 C211 C212 C214-C216 C221-C223 C225 CREFA200 = Cap Semi: Capacitor (Semiconductor SIM Model); Published: 8-Jun-2000; LatestRevisionDate: 29-May-2009; LatestRevisionNote: IPC-7351 Footprint Added.; PackageReference: C1206; Publisher: Altium Limited; PackageDescription: Chip Capacitor
FB200 FB201 = Inductor: Code_IEC: 1005; Published: 8-Jun-2000; LatestRevisionDate: 29-May-2009; LatestRevisionNote: IPC-7351 Footprint Added.; PackageReference: 0402-A; Publisher: Altium Limited; PackageDescription: Chip Inductor; Code_JEITA: 0402
P200-P203 = Header 3: Header, 3-Pin; LatestRevisionDate: 17-Jul-2002; LatestRevisionNote: Re-released for DXP Platform.; Publisher: Altium Limited
P204 P208 = Header 2: Header, 2-Pin; LatestRevisionDate: 17-Jul-2002; LatestRevisionNote: Re-released for DXP Platform.; Publisher: Altium Limited
U200 = CMP-0977-00016-1: Ultra-High-Precision, Ultra-Low-Noise, Series Voltage Reference, 4.096 V, -40 to 125 degC, 8-Pin SOIC (S8+4), RoHS, Tube; Manufacturer: Maxim; Output Voltage Accuracy: 0.02% Max.; Line Regulation: 60 uV/V Max.; VOUT: 4.096 V; Dropout Voltage@10 mA: 0.1 V Typ.; VIN: 4.3 to 12.6 V; Operating Temperature: -40 to 125 degC; ComponentLink3URL: http://pdfserv.maximintegrated.com/package_dwgs/21-0041.PDF; PartNumber: MAX6126AASA41+; RoHS: TRUE; ComponentLink3Description: Package Specification; ComponentLink1URL: http://www.maximintegrated.com/; Mounting Technology: Surface Mount; Packing: Tube; DatasheetVersion: Rev. 6; ComponentLink1Description: Manufacturer URL; ComponentLink2URL: http://datasheets.maximintegrated.com/en/ds/MAX6126.pdf; PackageDescription: 8-Pin Small Outline Integrated Circuit Package, Body 4.9 x 3.9 mm, Pitch 1.27 mm; ComponentLink2Description: Datasheet; PackageVersion: Rev. E

## Sheet HydrophoneGroup2FilterAndAmpCircuit.SchDoc
size C
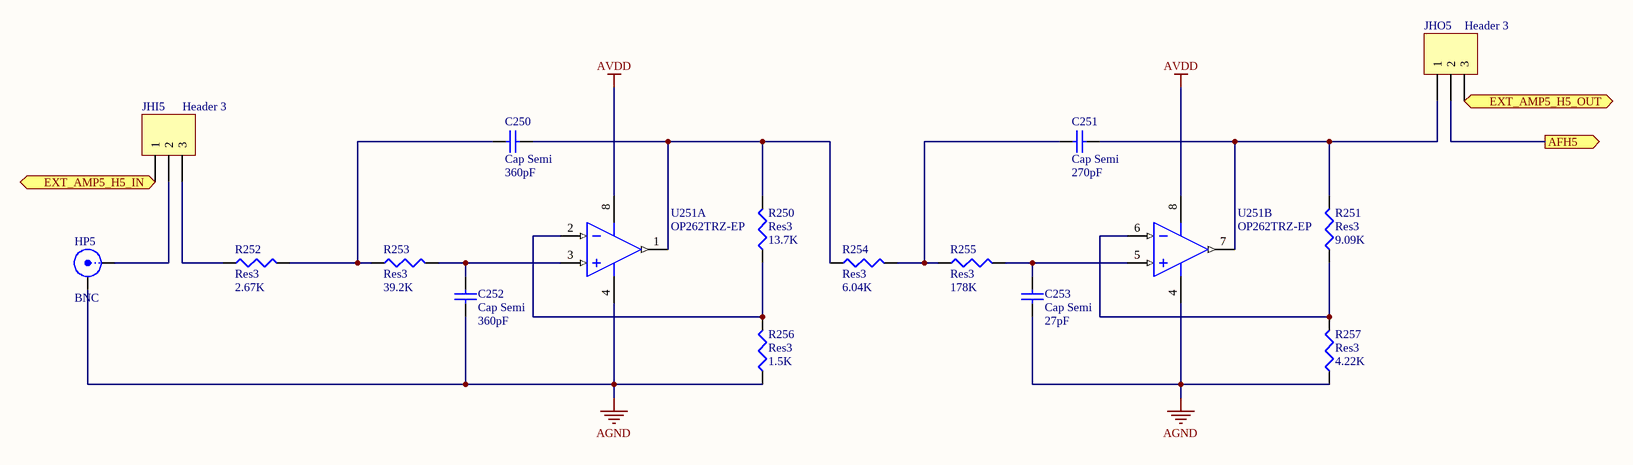
[diagram p4: HydrophoneGroup2FilterAndAmpCircuit.SchDoc]

### Parts
C250  Cap Semi  value 360pF  [1608[0603]]
C251  Cap Semi  value 270pF  [1608[0603]]
C252  Cap Semi  value 360pF  [1608[0603]]
C253  Cap Semi  value 27pF  [1608[0603]]
HP5  BNC  [BNC_RA CON]
JHI5  Header 3  [HDR1X3]
JHO5  Header 3  [HDR1X3]
R250  Res3  value 13.7K  [J1-0603]
R251  Res3  value 9.09K  [J1-0603]
R252  Res3  value 2.67K  [J1-0603]
R253  Res3  value 39.2K  [J1-0603]
R254  Res3  value 6.04K  [J1-0603]
R255  Res3  value 178K  [J1-0603]
R256  Res3  value 1.5K  [J1-0603]
R257  Res3  value 4.22K  [J1-0603]
U251  OP262TRZ-EP  [ADI-R-8_N]  (parts A,B of 2)

### Ports
AFH5 (out), EXT_AMP5_H5_IN, EXT_AMP5_H5_OUT

### Nets
AGND: C252.1 C253.1 HP5.2(Y) R256.1 R257.1 U251.4(-V)
AVDD: U251.8(+V)
AINAP2: JHO5.2 ; port AFH5
EXT_AMP5_H5_IN: JHI5.1 ; port EXT_AMP5_H5_IN
EXT_AMP5_H5_OUT: JHO5.3 ; port EXT_AMP5_H5_OUT
NetC250_1: C250.1 R252.2 R253.1
NetC250_2: C250.2 R250.2 R254.1 U251.1(OUT_A)
NetC251_1: C251.1 R254.2 R255.1
NetC251_2: C251.2 JHO5.1 R251.2 U251.7(OUT_B)
NetC252_2: C252.2 R253.2 U251.3(+IN_A)
NetC253_2: C253.2 R255.2 U251.5(+IN_B)
NetHP5_1: HP5.1(X) JHI5.2
NetJHI5_3: JHI5.3 R252.1
NetR250_1: R250.1 R256.2 U251.2(-IN_A)
NetR251_1: R251.1 R257.2 U251.6(-IN_B)

### Library data of the parts
C250-C253 = Cap Semi: Capacitor (Semiconductor SIM Model); Published: 8-Jun-2000; LatestRevisionDate: 29-May-2009; LatestRevisionNote: IPC-7351 Footprint Added.; PackageReference: C1206; Publisher: Altium Limited; PackageDescription: Chip Capacitor
HP5 = BNC: BNC Elbow Connector; LatestRevisionDate: 17-Jul-2002; LatestRevisionNote: Re-released for DXP Platform.; Publisher: Altium Limited
JHI5 JHO5 = Header 3: Header, 3-Pin; LatestRevisionDate: 17-Jul-2002; LatestRevisionNote: Re-released for DXP Platform.; Publisher: Altium Limited
R250-R257 = Res3: Resistor; Published: 8-Jun-2000; LatestRevisionDate: 29-May-2009; LatestRevisionNote: IPC-7351 Footprint Added.; PackageReference: J1-0603; Publisher: Altium Limited; PackageDescription: Chip Resistor
U251 = OP262TRZ-EP: Double Channel Wide Bandwidth Operational Amplifier, 15 MHz BW, 13 V/us SR, Military, 8-pin SOIC (R-8), Tube; Generic Part Number: OP262; Manufacturer: Analog Devices; Amplifiers Per Package: 2; Input Bias Current: 260nA; Input Offset Voltage: 25uV; Iq/Amp: 775uA; Slew Rate: 13V/us; Small Signal Bandwidth: 15MHz; V Span Max: 12V; V Span Min: 2.7V; DatasheetVersion: Rev. G; PackageVersion: 060506-A; PackageReference: R-8; PackageDescription: 8-Pin Standard Small Outline Package, Body 3.9 x 4.9 mm, Pitch 1.27 mm; Supplier 1: Digi-Key; Supplier Part Number 1: OP262TRZ-EP-ND; Supplier 2: Newark; Supplier Part Number 2: 85R9009; Packing: Tube; Mounting Technology: Surface Mount; Code_JEDEC: MS-012-AA; PartNumber: OP262TRZ-EP; ComponentLink1Description: Manufacturer URL; ComponentLink1URL: http://www.analog.com/en/index.html; ComponentLink2Description: Datasheet; ComponentLink2URL: http://www.analog.com/static/imported-files/data_sheets/OP162_262_462.pdf; ComponentLink3Description: Package Specification; ComponentLink3URL: http://www.analog.com/static/imported-files/packages/PKG_PDF/SOIC_Narrow%20(R)/R_8.pdf

## Sheet MAXIM-ADC1.SchDoc
size B
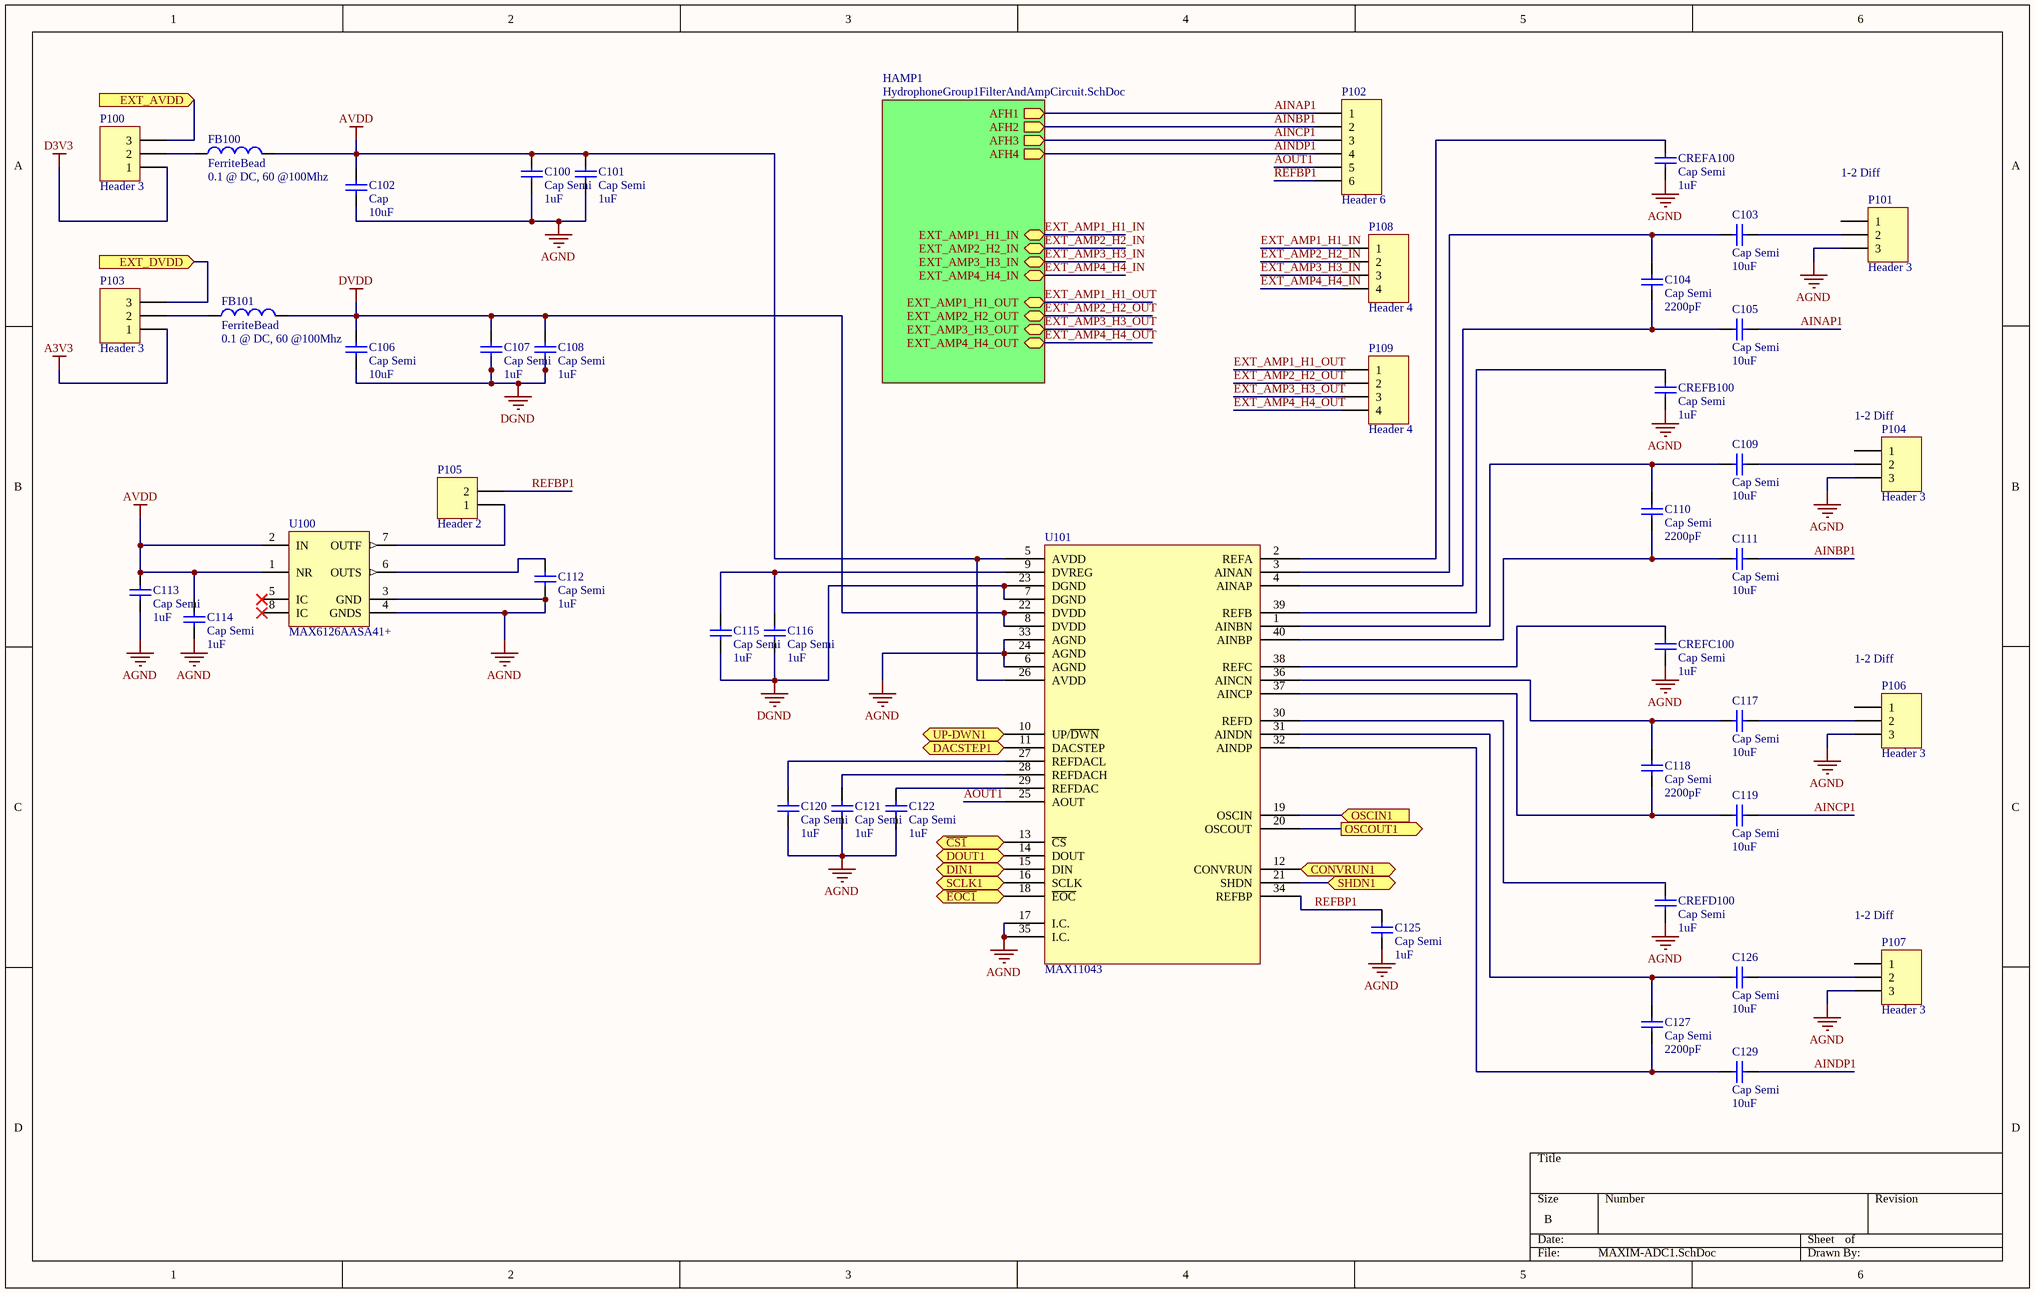
[diagram p5: MAXIM-ADC1.SchDoc]

### Parts
C100  Cap Semi  value 1uF  [1608[0603]]
C101  Cap Semi  value 1uF  [1608[0603]]
C102  Cap  value 10uF  [1608[0603]]
C103  Cap Semi  value 10uF  [1608[0603]]
C104  Cap Semi  value 2200pF  [1608[0603]]
C105  Cap Semi  value 10uF  [1608[0603]]
C106  Cap Semi  value 10uF  [C1206]
C107  Cap Semi  value 1uF  [1608[0603]]
C108  Cap Semi  value 1uF  [C1206]
C109  Cap Semi  value 10uF  [1608[0603]]
C110  Cap Semi  value 2200pF  [1608[0603]]
C111  Cap Semi  value 10uF  [1608[0603]]
C112  Cap Semi  value 1uF  [1608[0603]]
C113  Cap Semi  value 1uF  [1608[0603]]
C114  Cap Semi  value 1uF  [1608[0603]]
C115  Cap Semi  value 1uF  [1608[0603]]
C116  Cap Semi  value 1uF  [1608[0603]]
C117  Cap Semi  value 10uF  [1608[0603]]
C118  Cap Semi  value 2200pF  [1608[0603]]
C119  Cap Semi  value 10uF  [1608[0603]]
C120  Cap Semi  value 1uF  [1608[0603]]
C121  Cap Semi  value 1uF  [1608[0603]]
C122  Cap Semi  value 1uF  [1608[0603]]
C125  Cap Semi  value 1uF  [1608[0603]]
C126  Cap Semi  value 10uF  [1608[0603]]
C127  Cap Semi  value 2200pF  [1608[0603]]
C129  Cap Semi  value 10uF  [1608[0603]]
CREFA100  Cap Semi  value 1uF  [1608[0603]]
CREFB100  Cap Semi  value 1uF  [1608[0603]]
CREFC100  Cap Semi  value 1uF  [1608[0603]]
CREFD100  Cap Semi  value 1uF  [1608[0603]]
FB100  FerriteBead  value 0.1 @ DC, 60 @100Mhz  [0603]
FB101  FerriteBead  value 0.1 @ DC, 60 @100Mhz  [0603]
P100  Header 3  [HDR1X3]
P101  Header 3  [HDR1X3]
P102  Header 6  [HDR1X6]
P103  Header 3  [HDR1X3]
P104  Header 3  [HDR1X3]
P105  Header 2  [HDR1X2]
P106  Header 3  [HDR1X3]
P107  Header 3  [HDR1X3]
P108  Header 4  [HDR1X4]
P109  Header 4  [HDR1X4]
U100  MAX6126AASA41+  [MAXM-S8+4_L]
U101  MAX11043  [QFN50P600X600X80_HS-41N]

### Sub-sheets
HAMP1 = HydrophoneGroup1FilterAndAmpCircuit.SchDoc: AFH1 (out), AFH2 (out), AFH3 (out), AFH4 (out), EXT_AMP1_H1_IN, EXT_AMP2_H2_IN, EXT_AMP3_H3_IN, EXT_AMP4_H4_IN, EXT_AMP1_H1_OUT, EXT_AMP2_H2_OUT, EXT_AMP3_H3_OUT, EXT_AMP4_H4_OUT

### Ports
CONVRUN1 (in), DACSTEP1 (in), DIN1 (in), DOUT1 (out), EXT_AVDD (in), EXT_DVDD (in), OSCIN1 (in), OSCOUT1 (out), SCLK1 (in), SHDN1, UP-DWN1 (in), ~{CS1} (in), ~{EOC1} (out)

### Nets
A3V3: P103.1
AGND: C100.2 C101.2 C102.2 C112.2 C113.2 C114.2 C120.1 C121.2 C122.1 C125.2 CREFA100.1 CREFB100.1 CREFC100.1 CREFD100.1 P101.3 P104.3 P106.3 P107.3 U100.3(GND) U100.4(GNDS) U101.6(AGND) U101.17(I.C.) U101.24(AGND) U101.33(AGND) U101.35(I.C.)
AVDD: C100.1 C101.1 C102.1 C113.1 C114.1 FB100.2 U100.1(NR) U100.2(IN) U101.5(AVDD) U101.26(AVDD)
D3V3: P100.1
DGND: C106.2 C107.2 C108.2 C115.2 C116.2 U101.7(DGND) U101.23(DGND)
DVDD: C106.1 C107.1 C108.1 FB101.2 U101.8(DVDD) U101.22(DVDD)
AINAP1: C105.1 P102.1 ; sheet HAMP1/AFH1
AINBP1: C111.1 P102.2 ; sheet HAMP1/AFH2
AINCP1: C119.1 P102.3 ; sheet HAMP1/AFH3
AINDP1: C129.1 P102.4 ; sheet HAMP1/AFH4
AOUT1: P102.5 U101.25(AOUT)
EXT_AMP1_H1_IN: P108.1 ; sheet HAMP1/EXT_AMP1_H1_IN
EXT_AMP1_H1_OUT: P109.1 ; sheet HAMP1/EXT_AMP1_H1_OUT
EXT_AMP2_H2_IN: P108.2 ; sheet HAMP1/EXT_AMP2_H2_IN
EXT_AMP2_H2_OUT: P109.2 ; sheet HAMP1/EXT_AMP2_H2_OUT
EXT_AMP3_H3_IN: P108.3 ; sheet HAMP1/EXT_AMP3_H3_IN
EXT_AMP3_H3_OUT: P109.3 ; sheet HAMP1/EXT_AMP3_H3_OUT
EXT_AMP4_H4_IN: P108.4 ; sheet HAMP1/EXT_AMP4_H4_IN
EXT_AMP4_H4_OUT: P109.4 ; sheet HAMP1/EXT_AMP4_H4_OUT
M1_EXT_AV: P100.3 ; port EXT_AVDD
M1_EXT_DV: P103.3 ; port EXT_DVDD
MAX1_OSCOUT: U101.20(OSCOUT) ; port OSCOUT1
PA5_SCLK: U101.16(SCLK) ; port SCLK1
PA6_MISO: U101.14(DOUT) ; port DOUT1
PA7_MOSI: U101.15(DIN) ; port DIN1
PA8_MCO1: U101.19(OSCIN) ; port OSCIN1
PB0_SHDN1: U101.21(SHDN) ; port SHDN1
PB1_UP-DWN1: U101.10(UP/~{DWN}) ; port UP-DWN1
PB2_DACSTEP1: U101.11(DACSTEP) ; port DACSTEP1
PB10_CONVRUN1: U101.12(CONVRUN) ; port CONVRUN1
PB13_EOC1: U101.18(~{EOC}) ; port ~{EOC1}
PD0_CS1: U101.13(~{CS}) ; port ~{CS1}
REFBP1: C125.1 P102.6 P105.2 U101.34(REFBP)
NetC103_1: C103.1 P101.2
NetC103_2: C103.2 C104.2 U101.3(AINAN)
NetC104_1: C104.1 C105.2 U101.4(AINAP)
NetC109_1: C109.1 P104.2
NetC109_2: C109.2 C110.2 U101.1(AINBN)
NetC110_1: C110.1 C111.2 U101.40(AINBP)
NetC112_1: C112.1 U100.6(OUTS)
NetC115_1: C115.1 C116.1 U101.9(DVREG)
NetC117_1: C117.1 P106.2
NetC117_2: C117.2 C118.2 U101.36(AINCN)
NetC118_1: C118.1 C119.2 U101.37(AINCP)
NetC120_2: C120.2 U101.27(REFDACL)
NetC121_1: C121.1 U101.28(REFDACH)
NetC122_2: C122.2 U101.29(REFDAC)
NetC126_1: C126.1 P107.2
NetC126_2: C126.2 C127.2 U101.31(AINDN)
NetC127_1: C127.1 C129.2 U101.32(AINDP)
NetCREFA100_2: CREFA100.2 U101.2(REFA)
NetCREFB100_2: CREFB100.2 U101.39(REFB)
NetCREFC100_2: CREFC100.2 U101.38(REFC)
NetCREFD100_2: CREFD100.2 U101.30(REFD)
NetFB100_1: FB100.1 P100.2
NetFB101_1: FB101.1 P103.2
NetP105_1: P105.1 U100.7(OUTF)

Not connected (* = marked no-connect by the designer): P101 1; P104 1; P106 1; P107 1; U100 5(IC)* 8(IC)*

### Notes on the sheet
- (near P101) 1-2 Diff
- (near P104) 1-2 Diff
- (near P106) 1-2 Diff
- (near P107) 1-2 Diff

### Library data of the parts
C100-C122 C125-C127 C129 CREFA100 CREFB100 CREFC100 CREFD100 = Cap Semi: Capacitor (Semiconductor SIM Model); Published: 8-Jun-2000; LatestRevisionDate: 29-May-2009; LatestRevisionNote: IPC-7351 Footprint Added.; PackageReference: C1206; Publisher: Altium Limited; PackageDescription: Chip Capacitor
FB100 FB101 = Inductor: Code_IEC: 1005; Published: 8-Jun-2000; LatestRevisionDate: 29-May-2009; LatestRevisionNote: IPC-7351 Footprint Added.; PackageReference: 0402-A; Publisher: Altium Limited; PackageDescription: Chip Inductor; Code_JEITA: 0402
P100 P101 P103 P104 P106 P107 = Header 3: Header, 3-Pin; LatestRevisionDate: 17-Jul-2002; LatestRevisionNote: Re-released for DXP Platform.; Publisher: Altium Limited
P102 = Header 6: Header, 6-Pin; LatestRevisionDate: 17-Jul-2002; LatestRevisionNote: Re-released for DXP Platform.; Publisher: Altium Limited
P105 = Header 2: Header, 2-Pin; LatestRevisionDate: 17-Jul-2002; LatestRevisionNote: Re-released for DXP Platform.; Publisher: Altium Limited
P108 P109 = Header 4: Header, 4-Pin; LatestRevisionDate: 17-Jul-2002; LatestRevisionNote: Re-released for DXP Platform.; Publisher: Altium Limited
U100 = CMP-0977-00016-1: as U200 on sheet MAXIM-ADC2; Operating Temperature: -40 to 125 degC; ComponentLink3URL: http://pdfserv.maximintegrated.com/package_dwgs/21-0041.PDF; PartNumber: MAX6126AASA41+; RoHS: TRUE; ComponentLink3Description: Package Specification; ComponentLink1URL: http://www.maximintegrated.com/; Mounting Technology: Surface Mount; Packing: Tube; DatasheetVersion: Rev. 6; ComponentLink1Description: Manufacturer URL; ComponentLink2URL: http://datasheets.maximintegrated.com/en/ds/MAX6126.pdf; PackageDescription: 8-Pin Small Outline Integrated Circuit Package, Body 4.9 x 3.9 mm, Pitch 1.27 mm; ComponentLink2Description: Datasheet; PackageVersion: Rev. E

## Sheet HydrophoneGroup1FilterAndAmpCircuit.SchDoc
size C
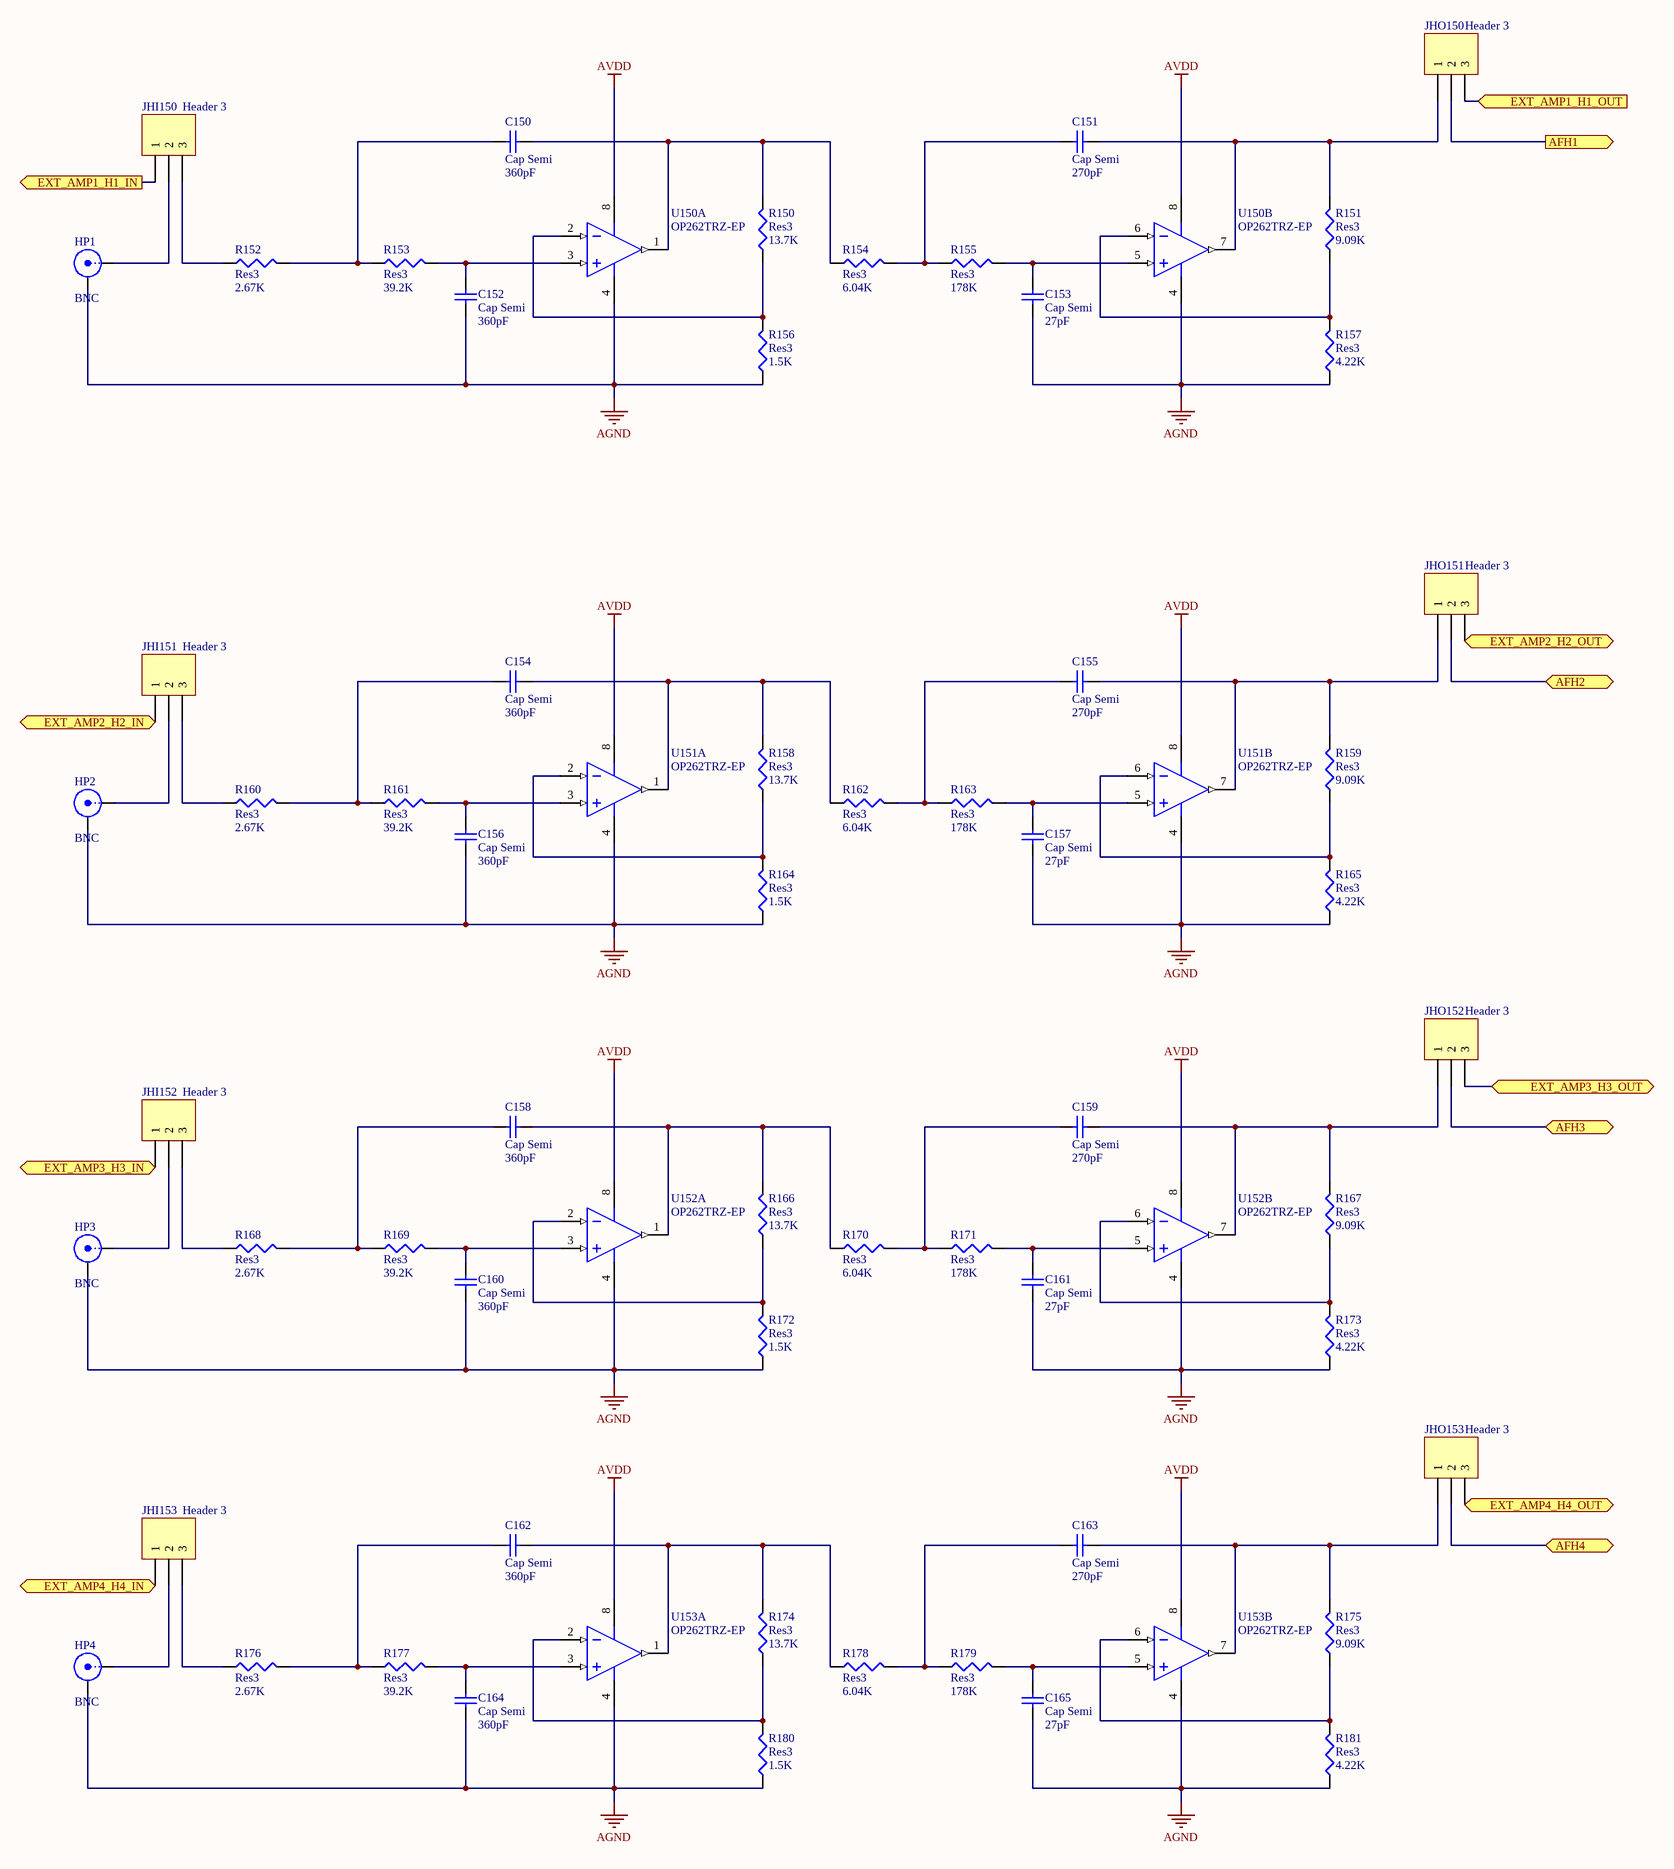
[diagram p6: HydrophoneGroup1FilterAndAmpCircuit.SchDoc]

### Parts
C150  Cap Semi  value 360pF  [1608[0603]]
C151  Cap Semi  value 270pF  [1608[0603]]
C152  Cap Semi  value 360pF  [1608[0603]]
C153  Cap Semi  value 27pF  [1608[0603]]
C154  Cap Semi  value 360pF  [1608[0603]]
C155  Cap Semi  value 270pF  [1608[0603]]
C156  Cap Semi  value 360pF  [1608[0603]]
C157  Cap Semi  value 27pF  [1608[0603]]
C158  Cap Semi  value 360pF  [1608[0603]]
C159  Cap Semi  value 270pF  [1608[0603]]
C160  Cap Semi  value 360pF  [1608[0603]]
C161  Cap Semi  value 27pF  [1608[0603]]
C162  Cap Semi  value 360pF  [1608[0603]]
C163  Cap Semi  value 270pF  [1608[0603]]
C164  Cap Semi  value 360pF  [1608[0603]]
C165  Cap Semi  value 27pF  [1608[0603]]
HP1  BNC  [BNC_RA CON]
HP2  BNC  [BNC_RA CON]
HP3  BNC  [BNC_RA CON]
HP4  BNC  [BNC_RA CON]
JHI150  Header 3  [HDR1X3]
JHI151  Header 3  [HDR1X3]
JHI152  Header 3  [HDR1X3]
JHI153  Header 3  [HDR1X3]
JHO150  Header 3  [HDR1X3]
JHO151  Header 3  [HDR1X3]
JHO152  Header 3  [HDR1X3]
JHO153  Header 3  [HDR1X3]
R150  Res3  value 13.7K  [J1-0603]
R151  Res3  value 9.09K  [J1-0603]
R152  Res3  value 2.67K  [J1-0603]
R153  Res3  value 39.2K  [J1-0603]
R154  Res3  value 6.04K  [J1-0603]
R155  Res3  value 178K  [J1-0603]
R156  Res3  value 1.5K  [J1-0603]
R157  Res3  value 4.22K  [J1-0603]
R158  Res3  value 13.7K  [J1-0603]
R159  Res3  value 9.09K  [J1-0603]
R160  Res3  value 2.67K  [J1-0603]
R161  Res3  value 39.2K  [J1-0603]
R162  Res3  value 6.04K  [J1-0603]
R163  Res3  value 178K  [J1-0603]
R164  Res3  value 1.5K  [J1-0603]
R165  Res3  value 4.22K  [J1-0603]
R166  Res3  value 13.7K  [J1-0603]
R167  Res3  value 9.09K  [J1-0603]
R168  Res3  value 2.67K  [J1-0603]
R169  Res3  value 39.2K  [J1-0603]
R170  Res3  value 6.04K  [J1-0603]
R171  Res3  value 178K  [J1-0603]
R172  Res3  value 1.5K  [J1-0603]
R173  Res3  value 4.22K  [J1-0603]
R174  Res3  value 13.7K  [J1-0603]
R175  Res3  value 9.09K  [J1-0603]
R176  Res3  value 2.67K  [J1-0603]
R177  Res3  value 39.2K  [J1-0603]
R178  Res3  value 6.04K  [J1-0603]
R179  Res3  value 178K  [J1-0603]
R180  Res3  value 1.5K  [J1-0603]
R181  Res3  value 4.22K  [J1-0603]
U150  OP262TRZ-EP  [ADI-R-8_N]  (parts A,B of 2)
U151  OP262TRZ-EP  [ADI-R-8_N]  (parts A,B of 2)
U152  OP262TRZ-EP  [ADI-R-8_N]  (parts A,B of 2)
U153  OP262TRZ-EP  [ADI-R-8_N]  (parts A,B of 2)

### Ports
AFH1 (out), AFH2, AFH3, AFH4, EXT_AMP1_H1_IN (out), EXT_AMP1_H1_OUT (in), EXT_AMP2_H2_IN, EXT_AMP2_H2_OUT, EXT_AMP3_H3_IN, EXT_AMP3_H3_OUT, EXT_AMP4_H4_IN, EXT_AMP4_H4_OUT

### Nets
AGND: C152.1 C153.1 C156.1 C157.1 C160.1 C161.1 C164.1 C165.1 HP1.2(Y) HP2.2(Y) HP3.2(Y) HP4.2(Y) R156.1 R157.1 R164.1 R165.1 R172.1 R173.1 R180.1 R181.1 U150.4(-V) U151.4(-V) U152.4(-V) U153.4(-V)
AVDD: U150.8(+V) U151.8(+V) U152.8(+V) U153.8(+V)
AINAP1: JHO150.2 ; port AFH1
AINBP1: JHO151.2 ; port AFH2
AINCP1: JHO152.2 ; port AFH3
AINDP1: JHO153.2 ; port AFH4
EXT_AMP1_H1_IN: JHI150.1 ; port EXT_AMP1_H1_IN
EXT_AMP1_H1_OUT: JHO150.3 ; port EXT_AMP1_H1_OUT
EXT_AMP2_H2_IN: JHI151.1 ; port EXT_AMP2_H2_IN
EXT_AMP2_H2_OUT: JHO151.3 ; port EXT_AMP2_H2_OUT
EXT_AMP3_H3_IN: JHI152.1 ; port EXT_AMP3_H3_IN
EXT_AMP3_H3_OUT: JHO152.3 ; port EXT_AMP3_H3_OUT
EXT_AMP4_H4_IN: JHI153.1 ; port EXT_AMP4_H4_IN
EXT_AMP4_H4_OUT: JHO153.3 ; port EXT_AMP4_H4_OUT
NetC150_1: C150.1 R152.2 R153.1
NetC150_2: C150.2 R150.2 R154.1 U150.1(OUT_A)
NetC151_1: C151.1 R154.2 R155.1
NetC151_2: C151.2 JHO150.1 R151.2 U150.7(OUT_B)
NetC152_2: C152.2 R153.2 U150.3(+IN_A)
NetC153_2: C153.2 R155.2 U150.5(+IN_B)
NetC154_1: C154.1 R160.2 R161.1
NetC154_2: C154.2 R158.2 R162.1 U151.1(OUT_A)
NetC155_1: C155.1 R162.2 R163.1
NetC155_2: C155.2 JHO151.1 R159.2 U151.7(OUT_B)
NetC156_2: C156.2 R161.2 U151.3(+IN_A)
NetC157_2: C157.2 R163.2 U151.5(+IN_B)
NetC158_1: C158.1 R168.2 R169.1
NetC158_2: C158.2 R166.2 R170.1 U152.1(OUT_A)
NetC159_1: C159.1 R170.2 R171.1
NetC159_2: C159.2 JHO152.1 R167.2 U152.7(OUT_B)
NetC160_2: C160.2 R169.2 U152.3(+IN_A)
NetC161_2: C161.2 R171.2 U152.5(+IN_B)
NetC162_1: C162.1 R176.2 R177.1
NetC162_2: C162.2 R174.2 R178.1 U153.1(OUT_A)
NetC163_1: C163.1 R178.2 R179.1
NetC163_2: C163.2 JHO153.1 R175.2 U153.7(OUT_B)
NetC164_2: C164.2 R177.2 U153.3(+IN_A)
NetC165_2: C165.2 R179.2 U153.5(+IN_B)
NetHP1_1: HP1.1(X) JHI150.2
NetHP2_1: HP2.1(X) JHI151.2
NetHP3_1: HP3.1(X) JHI152.2
NetHP4_1: HP4.1(X) JHI153.2
NetJHI150_3: JHI150.3 R152.1
NetJHI151_3: JHI151.3 R160.1
NetJHI152_3: JHI152.3 R168.1
NetJHI153_3: JHI153.3 R176.1
NetR150_1: R150.1 R156.2 U150.2(-IN_A)
NetR151_1: R151.1 R157.2 U150.6(-IN_B)
NetR158_1: R158.1 R164.2 U151.2(-IN_A)
NetR159_1: R159.1 R165.2 U151.6(-IN_B)
NetR166_1: R166.1 R172.2 U152.2(-IN_A)
NetR167_1: R167.1 R173.2 U152.6(-IN_B)
NetR174_1: R174.1 R180.2 U153.2(-IN_A)
NetR175_1: R175.1 R181.2 U153.6(-IN_B)

### Library data of the parts
C150-C165 = Cap Semi: Capacitor (Semiconductor SIM Model); Published: 8-Jun-2000; LatestRevisionDate: 29-May-2009; LatestRevisionNote: IPC-7351 Footprint Added.; PackageReference: C1206; Publisher: Altium Limited; PackageDescription: Chip Capacitor
HP1-HP4 = BNC: BNC Elbow Connector; LatestRevisionDate: 17-Jul-2002; LatestRevisionNote: Re-released for DXP Platform.; Publisher: Altium Limited
JHI150-JHI153 JHO150-JHO153 = Header 3: Header, 3-Pin; LatestRevisionDate: 17-Jul-2002; LatestRevisionNote: Re-released for DXP Platform.; Publisher: Altium Limited
R150-R181 = Res3: Resistor; Published: 8-Jun-2000; LatestRevisionDate: 29-May-2009; LatestRevisionNote: IPC-7351 Footprint Added.; PackageReference: J1-0603; Publisher: Altium Limited; PackageDescription: Chip Resistor
U150-U153 = OP262TRZ-EP: as U251 on sheet HydrophoneGroup2FilterAndAmpCircuit; DatasheetVersion: Rev. G; PackageVersion: 060506-A; PackageReference: R-8; PackageDescription: 8-Pin Standard Small Outline Package, Body 3.9 x 4.9 mm, Pitch 1.27 mm; Supplier 1: Digi-Key; Supplier Part Number 1: OP262TRZ-EP-ND; Supplier 2: Newark; Supplier Part Number 2: 85R9009; Packing: Tube; Mounting Technology: Surface Mount; Code_JEDEC: MS-012-AA; PartNumber: OP262TRZ-EP; ComponentLink1Description: Manufacturer URL; ComponentLink1URL: http://www.analog.com/en/index.html; ComponentLink2Description: Datasheet; ComponentLink2URL: http://www.analog.com/static/imported-files/data_sheets/OP162_262_462.pdf; ComponentLink3Description: Package Specification; ComponentLink3URL: http://www.analog.com/static/imported-files/packages/PKG_PDF/SOIC_Narrow%20(R)/R_8.pdf

## Nets that join several sheets
A3V3: HANC1.0_SCH (C4.2 LMA1.3), MAXIM-ADC2 (P200.1), MAXIM-ADC1 (P103.1)
AGND: HANC1.0_SCH (8 pins), MAXIM-ADC2 (19 pins), HydrophoneGroup2FilterAndAmpCircuit (6 pins), MAXIM-ADC1 (25 pins), HydrophoneGroup1FilterAndAmpCircuit (24 pins)
AVDD: MAXIM-ADC2 (8 pins), HydrophoneGroup2FilterAndAmpCircuit (U251.8), MAXIM-ADC1 (10 pins), HydrophoneGroup1FilterAndAmpCircuit (U150.8 U151.8 U152.8 U153.8)
D3V3: HANC1.0_SCH (C2.2 LMD1.3), STM32F413VGT6 (25 pins), RS-232 (C39.1 T30.18 T30.19), MAXIM-ADC2 (P202.1), MAXIM-ADC1 (P100.1)
DGND: HANC1.0_SCH (25 pins), STM32F413VGT6 (14 pins), RS-232 (C39.2 C41.2 C42.2 T30.17), MAXIM-ADC2 (7 pins), MAXIM-ADC1 (7 pins)
DVDD: HANC1.0_SCH (6 pins), MAXIM-ADC2 (6 pins), MAXIM-ADC1 (6 pins)
AINAP1: MAXIM-ADC1 (C105.1 P102.1), HydrophoneGroup1FilterAndAmpCircuit (JHO150.2)
AINAP2: MAXIM-ADC2 (C205.1 P203.1), HydrophoneGroup2FilterAndAmpCircuit (JHO5.2)
AINBP1: MAXIM-ADC1 (C111.1 P102.2), HydrophoneGroup1FilterAndAmpCircuit (JHO151.2)
AINCP1: MAXIM-ADC1 (C119.1 P102.3), HydrophoneGroup1FilterAndAmpCircuit (JHO152.2)
AINDP1: MAXIM-ADC1 (C129.1 P102.4), HydrophoneGroup1FilterAndAmpCircuit (JHO153.2)
BOOT0: HANC1.0_SCH (P4.21), STM32F413VGT6 (U20#1.94)
EXT_AMP1_H1_IN: MAXIM-ADC1 (P108.1), HydrophoneGroup1FilterAndAmpCircuit (JHI150.1)
EXT_AMP1_H1_OUT: MAXIM-ADC1 (P109.1), HydrophoneGroup1FilterAndAmpCircuit (JHO150.3)
EXT_AMP2_H2_IN: MAXIM-ADC1 (P108.2), HydrophoneGroup1FilterAndAmpCircuit (JHI151.1)
EXT_AMP2_H2_OUT: MAXIM-ADC1 (P109.2), HydrophoneGroup1FilterAndAmpCircuit (JHO151.3)
EXT_AMP3_H3_IN: MAXIM-ADC1 (P108.3), HydrophoneGroup1FilterAndAmpCircuit (JHI152.1)
EXT_AMP3_H3_OUT: MAXIM-ADC1 (P109.3), HydrophoneGroup1FilterAndAmpCircuit (JHO152.3)
EXT_AMP4_H4_IN: MAXIM-ADC1 (P108.4), HydrophoneGroup1FilterAndAmpCircuit (JHI153.1)
EXT_AMP4_H4_OUT: MAXIM-ADC1 (P109.4), HydrophoneGroup1FilterAndAmpCircuit (JHO153.3)
EXT_AMP5_H5_IN: MAXIM-ADC2 (P208.1), HydrophoneGroup2FilterAndAmpCircuit (JHI5.1)
EXT_AMP5_H5_OUT: MAXIM-ADC2 (P208.2), HydrophoneGroup2FilterAndAmpCircuit (JHO5.3)
M1_EXT_AV: HANC1.0_SCH (P7.1), MAXIM-ADC1 (P100.3)
M1_EXT_DV: HANC1.0_SCH (P7.2), MAXIM-ADC1 (P103.3)
M2_EXT_AV: HANC1.0_SCH (P8.1), MAXIM-ADC2 (P200.3)
M2_EXT_DV: HANC1.0_SCH (P8.2), MAXIM-ADC2 (P202.3)
MAX1_OSCOUT: HANC1.0_SCH (C1.2), MAXIM-ADC1 (U101.20)
MAX2_OSCOUT: HANC1.0_SCH (C6.2), MAXIM-ADC2 (U201.20)
NRST: HANC1.0_SCH (P1.5 P3.6), STM32F413VGT6 (U20#1.14)
PA0: HANC1.0_SCH (P3.12), STM32F413VGT6 (U20#1.23)
PA1: HANC1.0_SCH (P3.11), STM32F413VGT6 (U20#1.24)
PA2_USART2_TX: HANC1.0_SCH (P3.14), STM32F413VGT6 (U20#1.25), RS-232 (T30.10)
PA3_USART2_RX: HANC1.0_SCH (P3.13), STM32F413VGT6 (U20#1.26), RS-232 (T30.11)
PA4: HANC1.0_SCH (P3.16), STM32F413VGT6 (U20#1.29)
PA5_SCLK: HANC1.0_SCH (P3.15), STM32F413VGT6 (U20#1.30), MAXIM-ADC2 (U201.16), MAXIM-ADC1 (U101.16)
PA6_MISO: HANC1.0_SCH (P3.18), STM32F413VGT6 (U20#1.31), MAXIM-ADC2 (U201.14), MAXIM-ADC1 (U101.14)
PA7_MOSI: HANC1.0_SCH (P3.17), STM32F413VGT6 (U20#1.32), MAXIM-ADC2 (U201.15), MAXIM-ADC1 (U101.15)
PA8_MCO1: HANC1.0_SCH (P4.43), STM32F413VGT6 (U20#1.67), MAXIM-ADC1 (U101.19)
PA9: HANC1.0_SCH (P4.44), STM32F413VGT6 (U20#1.68)
PA10: HANC1.0_SCH (P4.41), STM32F413VGT6 (U20#1.69)
PA11: HANC1.0_SCH (P3.35), STM32F413VGT6 (U20#1.70)
PA12: HANC1.0_SCH (P3.48), STM32F413VGT6 (U20#1.71)
PA13_SWDIO: HANC1.0_SCH (P1.4 P4.42), STM32F413VGT6 (U20#1.72)
PA14_SWCLK: HANC1.0_SCH (P1.2 P4.39), STM32F413VGT6 (U20#1.76)
PA15: HANC1.0_SCH (P4.40), STM32F413VGT6 (U20#1.77)
PB0_SHDN1: HANC1.0_SCH (P3.22), STM32F413VGT6 (U20#1.35), MAXIM-ADC1 (U101.21)
PB1_UP-DWN1: HANC1.0_SCH (P3.21), STM32F413VGT6 (U20#1.36), MAXIM-ADC1 (U101.10)
PB2_DACSTEP1: HANC1.0_SCH (P3.24), STM32F413VGT6 (U20#1.37), MAXIM-ADC1 (U101.11)
PB3_SWO: HANC1.0_SCH (P1.6 P4.28), STM32F413VGT6 (U20#1.89)
PB4: HANC1.0_SCH (P4.25), STM32F413VGT6 (U20#1.90)
PB5: HANC1.0_SCH (P4.26), STM32F413VGT6 (U20#1.91)
PB6: HANC1.0_SCH (P4.23), STM32F413VGT6 (U20#1.92)
PB7: HANC1.0_SCH (P4.24), STM32F413VGT6 (U20#1.93)
PB8: HANC1.0_SCH (P4.19), STM32F413VGT6 (U20#1.95)
PB9: HANC1.0_SCH (P4.20), STM32F413VGT6 (U20#1.96)
PB10_CONVRUN1: HANC1.0_SCH (P3.34), STM32F413VGT6 (U20#1.47), MAXIM-ADC1 (U101.12)
PB12_EOC2: HANC1.0_SCH (P3.36), STM32F413VGT6 (U20#1.51), MAXIM-ADC2 (U201.18)
PB13_EOC1: HANC1.0_SCH (P3.37), STM32F413VGT6 (U20#1.52), MAXIM-ADC1 (U101.18)
PB14: HANC1.0_SCH (P3.38), STM32F413VGT6 (U20#1.53)
PB15: HANC1.0_SCH (P3.39), STM32F413VGT6 (U20#1.54)
PC0_FORCEON: HANC1.0_SCH (P3.8), STM32F413VGT6 (U20#1.15), RS-232 (T30.14)
PC1_FORCEOFF: HANC1.0_SCH (P3.7), STM32F413VGT6 (U20#1.16), RS-232 (T30.15)
PC2_INVALID: HANC1.0_SCH (P3.10), STM32F413VGT6 (U20#1.17), RS-232 (T30.13)
PC3: HANC1.0_SCH (P3.9), STM32F413VGT6 (U20#1.18)
PC4: HANC1.0_SCH (P3.20), STM32F413VGT6 (U20#1.33)
PC5: HANC1.0_SCH (P3.19), STM32F413VGT6 (U20#1.34)
PC6: HANC1.0_SCH (P4.47), STM32F413VGT6 (U20#1.63)
PC7: HANC1.0_SCH (P4.48), STM32F413VGT6 (U20#1.64)
PC8: HANC1.0_SCH (P4.45), STM32F413VGT6 (U20#1.65)
PC9_MCO2: HANC1.0_SCH (P4.46), STM32F413VGT6 (U20#1.66), MAXIM-ADC2 (U201.19)
PC10: HANC1.0_SCH (P4.37), STM32F413VGT6 (U20#1.78)
PC11: HANC1.0_SCH (P4.38), STM32F413VGT6 (U20#1.79)
PC12: HANC1.0_SCH (P4.35), STM32F413VGT6 (U20#1.80)
PC13: HANC1.0_SCH (P4.12), STM32F413VGT6 (U20#1.7)
PC14: HANC1.0_SCH (P4.9), STM32F413VGT6 (U20#1.8)
PC15: HANC1.0_SCH (P4.10), STM32F413VGT6 (U20#1.9)
PD0_CS1: HANC1.0_SCH (P4.36), STM32F413VGT6 (U20#1.81), MAXIM-ADC1 (U101.13)
PD1_CS2: HANC1.0_SCH (P4.33), STM32F413VGT6 (U20#1.82), MAXIM-ADC2 (U201.13)
PD2: HANC1.0_SCH (P4.34), STM32F413VGT6 (U20#1.83)
PD3: HANC1.0_SCH (P4.31), STM32F413VGT6 (U20#1.84)
PD4: HANC1.0_SCH (P4.32), STM32F413VGT6 (U20#1.85)
PD5: HANC1.0_SCH (P4.29), STM32F413VGT6 (U20#1.86)
PD6: HANC1.0_SCH (P4.30), STM32F413VGT6 (U20#1.87)
PD7: HANC1.0_SCH (P4.27), STM32F413VGT6 (U20#1.88)
PD8: HANC1.0_SCH (P3.40), STM32F413VGT6 (U20#1.55)
PD9: HANC1.0_SCH (P3.41), STM32F413VGT6 (U20#1.56)
PD10_SHDN2: HANC1.0_SCH (P3.42), STM32F413VGT6 (U20#1.57), MAXIM-ADC2 (U201.21)
PD11_UP-DWN2: HANC1.0_SCH (P3.43), STM32F413VGT6 (U20#1.58), MAXIM-ADC2 (U201.10)
PD12_DACSTEP2: HANC1.0_SCH (P3.44), STM32F413VGT6 (U20#1.59), MAXIM-ADC2 (U201.11)
PD13_LED1: HANC1.0_SCH (P3.45 R1.2), STM32F413VGT6 (U20#1.60)
PD14_LED2: HANC1.0_SCH (P3.46 R2.2), STM32F413VGT6 (U20#1.61)
PD15_LED3: HANC1.0_SCH (P3.47 R3.2), STM32F413VGT6 (U20#1.62)
PE0_LED4: HANC1.0_SCH (P4.17 R4.2), STM32F413VGT6 (U20#1.97)
PE1_LED5: HANC1.0_SCH (P4.18 R5.2), STM32F413VGT6 (U20#1.98)
PE2: HANC1.0_SCH (P4.15), STM32F413VGT6 (U20#1.1)
PE3: HANC1.0_SCH (P4.16), STM32F413VGT6 (U20#1.2)
PE4: HANC1.0_SCH (P4.13), STM32F413VGT6 (U20#1.3)
PE5: HANC1.0_SCH (P4.14), STM32F413VGT6 (U20#1.4)
PE6: HANC1.0_SCH (P4.11), STM32F413VGT6 (U20#1.5)
PE7: HANC1.0_SCH (P3.25), STM32F413VGT6 (U20#1.38)
PE8: HANC1.0_SCH (P3.26), STM32F413VGT6 (U20#1.39)
PE9: HANC1.0_SCH (P3.27), STM32F413VGT6 (U20#1.40)
PE10: HANC1.0_SCH (P3.28), STM32F413VGT6 (U20#1.41)
PE11: HANC1.0_SCH (P3.29), STM32F413VGT6 (U20#1.42)
PE12: HANC1.0_SCH (P3.30), STM32F413VGT6 (U20#1.43)
PE13: HANC1.0_SCH (P3.31), STM32F413VGT6 (U20#1.44)
PE14: HANC1.0_SCH (P3.32), STM32F413VGT6 (U20#1.45)
PE15_CONVRUN2: HANC1.0_SCH (P3.33), STM32F413VGT6 (U20#1.46), MAXIM-ADC2 (U201.12)
PH0-OSC_IN: HANC1.0_SCH (P4.7), STM32F413VGT6 (SB20.2)
PH1-OSC_OUT: HANC1.0_SCH (P4.8), STM32F413VGT6 (SB22.2)
RS232_IN: HANC1.0_SCH (P2.3), RS-232 (T30.4)
RS232_OUT: HANC1.0_SCH (P2.2), RS-232 (T30.5)